# EasyEDA Pro project 2轴5.0控制板PCB源文件（LY-2X5.0-V1.1）.eprj

# Schematic 2轴南塘
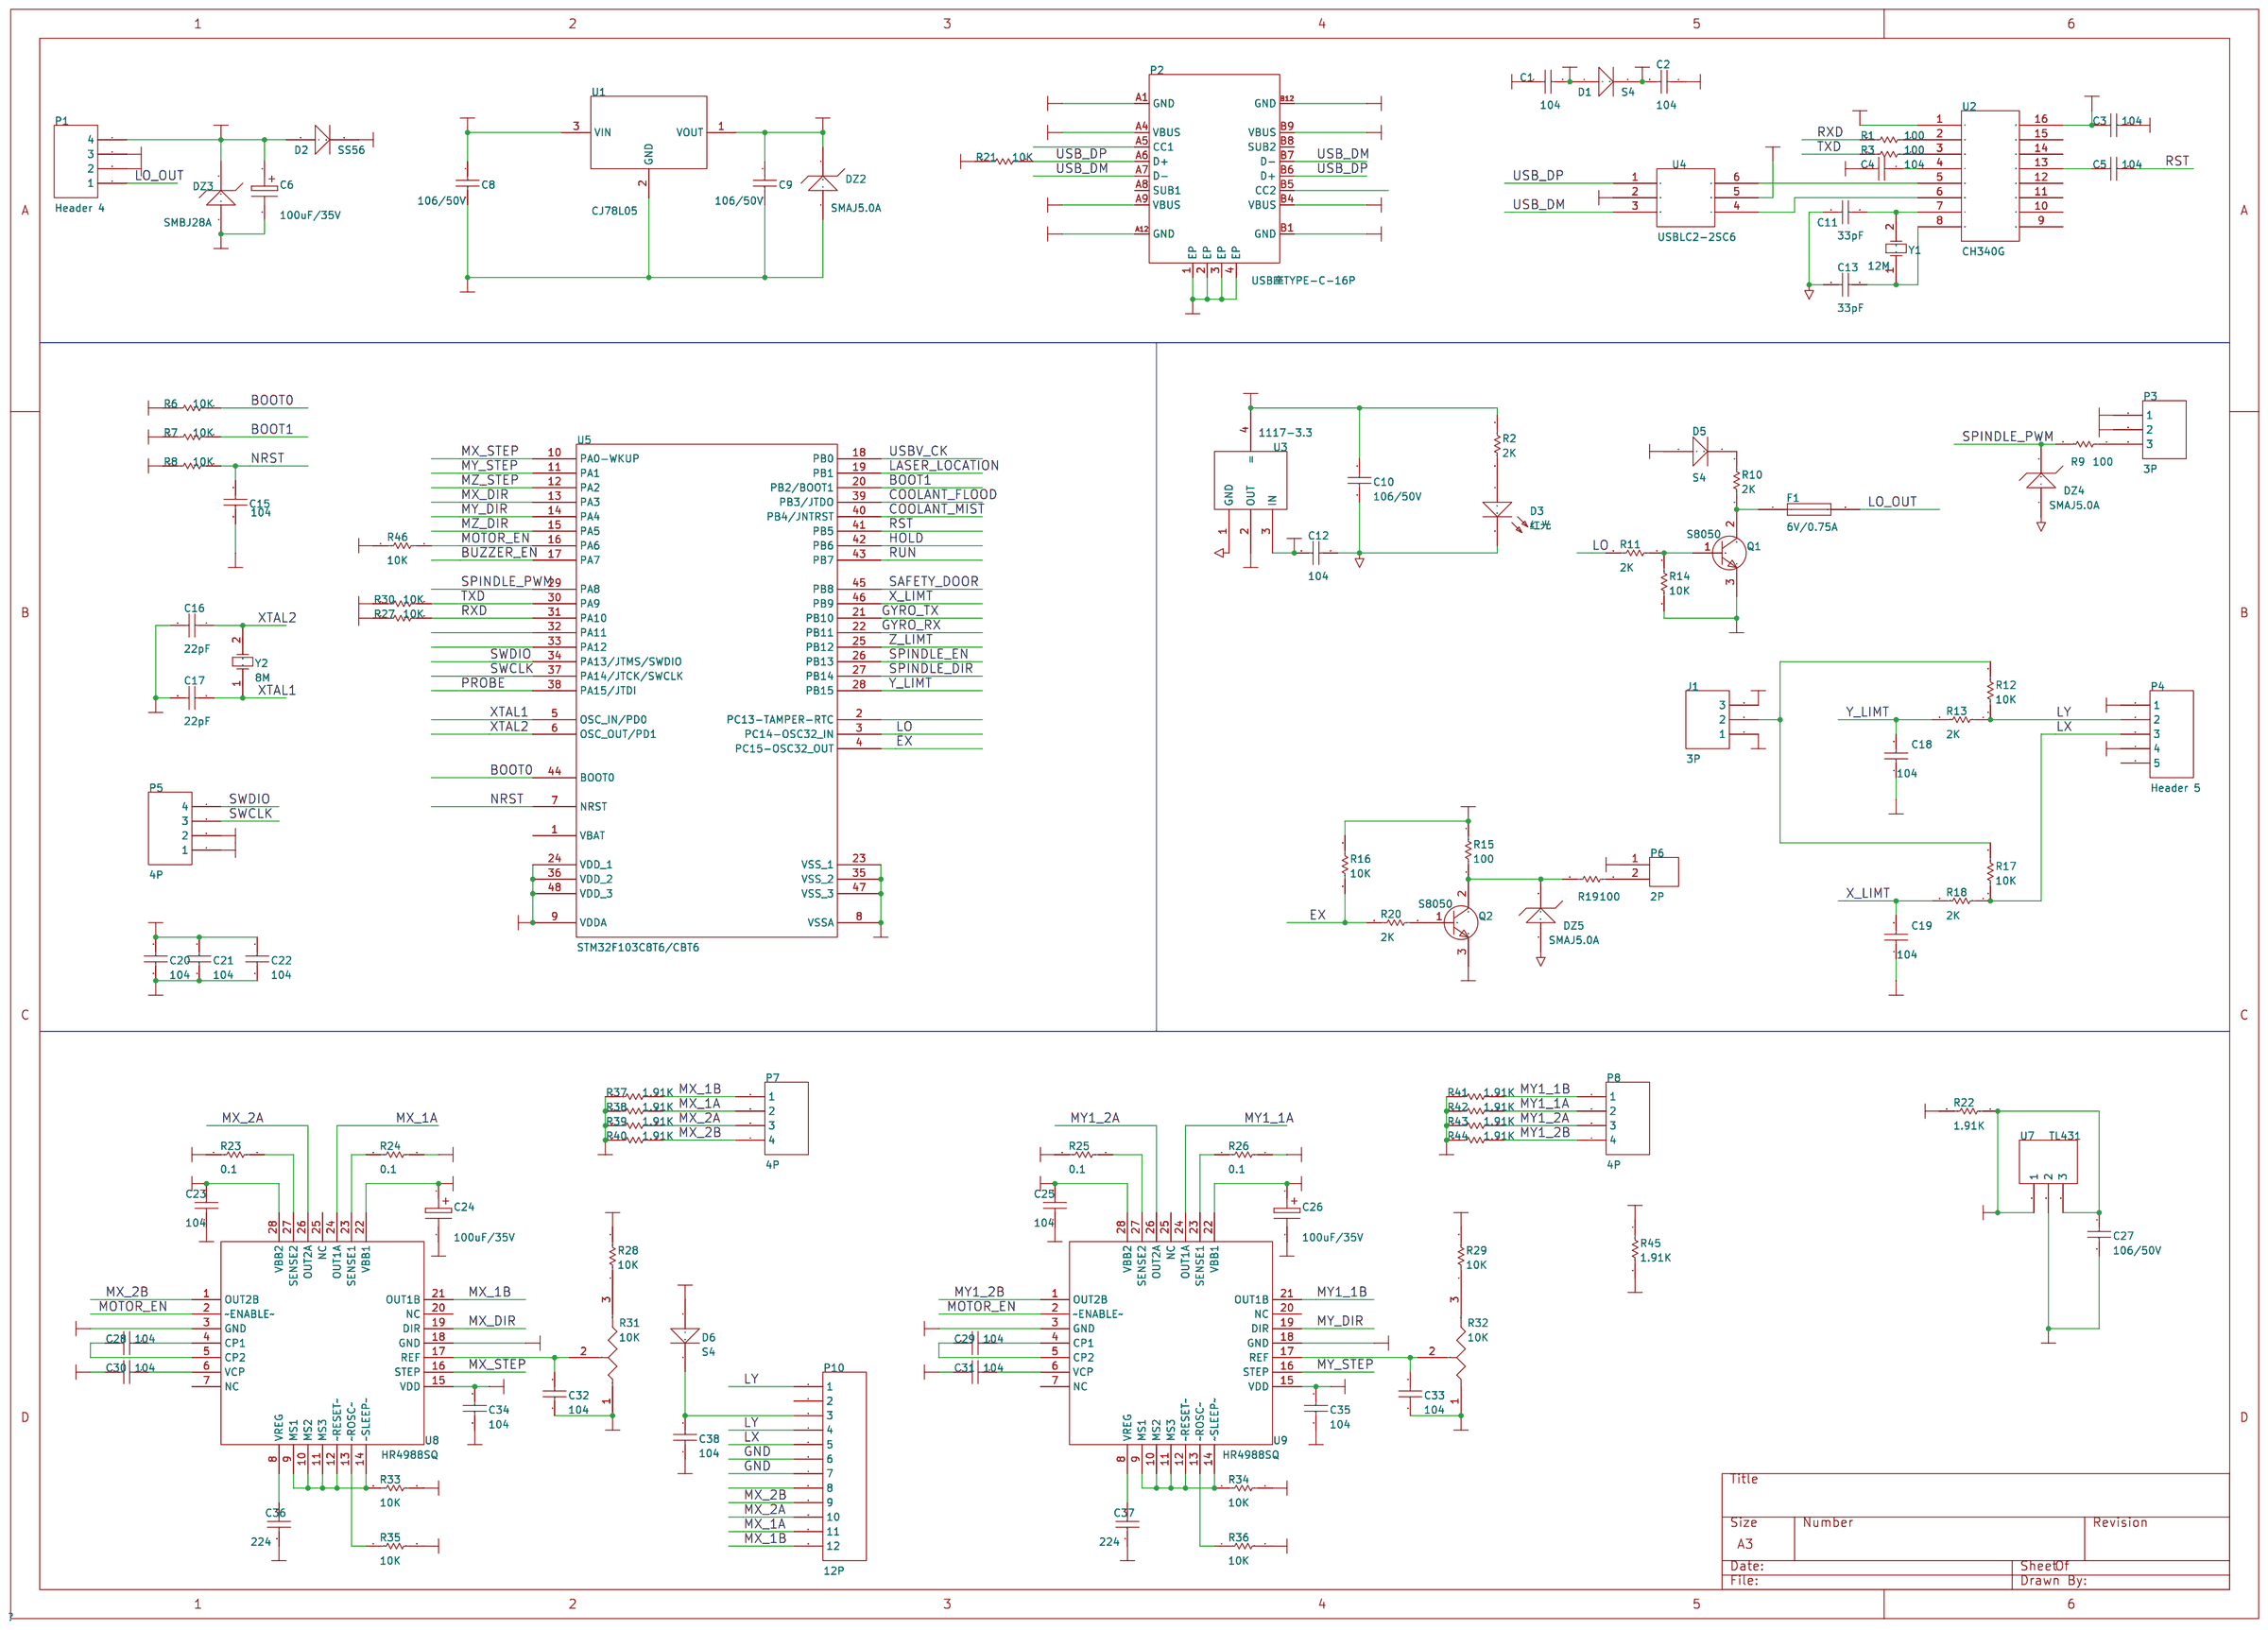
[diagram p0: schematic sheet]

## Parts
C1  104  [0603C]
C2  104  [0603C]
C3  104  [0603C]
C4  104  [0603C]
C5  104  [0603C]
C6  100uF/35V  [电容插件M6.3]
C8  106/50V  [1206C]
C9  106/50V  [电容插件M6.3]
C10  106/50V  [1206C]
C11  18pF  [0603C]
C12  104  [0603C]
C13  18pF  [0603C]
C15  104  [0603C]
C16  100pF  [0603C]
C17  100pF  [0603C]
C18  104  [0603C]
C19  104  [0603C]
C20  104  [0603C]
C21  104  [0603C]
C22  104  [0603C]
C23  104  [0603C]
C24  100uF/35V  [电容插件M6.3]
C25  104  [0603C]
C26  100uF/35V  [电容插件M6.3]
C27  106/50V  [1206C]
C28  104  [0603C]
C29  104  [0603C]
C30  104  [0603C]
C31  104  [0603C]
C32  104  [0603C]
C33  104  [0603C]
C34  104  [0603C]
C35  104  [0603C]
C36  224  [0603C]
C37  224  [0603C]
C38  104  [0603C]
D1  S4  [SOD-123]
D2  SS56  [SMA]
D3  红光  [0603LED]
D5  S4  [SOD-123]
D6  S4  [SOD-123]
DZ2  SMAJ5.0A  [SMA]
DZ3  SMBJ28A  [SMB]
DZ4  SMAJ5.0A  [SMA]
DZ5  SMAJ5.0A  [SMA]
F1  6V/0.75A  [1206R]
J1  3P  [SIP3]
P1  Header 4  [VH3.96-4P直插座]
P2  USB座TYPE-C-16P  [USB-TYPE-C-16P]
P3  3P  [HDR1X3_CON]
P4  Header 5  [HDR1X5_CON]
P5  4P  [SIP4]
P6  2P  [HDR1X2_CON]
P7  4P  [HDR1X4_CON]
P8  4P  [HDR1X4_CON]
P10  12P  [FFC/FPC直插座-1.25-12P]
Q1  S8050  [SOT-23]
Q2  S8050  [SOT-23]
R1  100  [0603R]
R2  2K  [0603R]
R3  100  [0603R]
R6  10K  [0603R]
R7  10K  [0603R]
R8  10K  [0603R]
R9  100  [0603R]
R10  2K  [0603R]
R11  2K  [0603R]
R12  10K  [0603R]
R13  2K  [0603R]
R14  10K  [0603R]
R15  100  [0603R]
R16  10K  [0603R]
R17  10K  [0603R]
R18  2K  [0603R]
R19  100  [0603R]
R20  2K  [0603R]
R21  10K  [0603R]
R22  1.91K  [1206R]
R23  0.1  [1206R]
R24  0.1  [1206R]
R25  0.1  [1206R]
R26  0.1  [1206R]
R27  10K  [0603R]
R28  10K  [0603R]
R29  10K  [0603R]
R30  10K  [0603R]
R31  10K  [松下贴片电位器3x3]
R32  10K  [松下贴片电位器3x3]
R33  10K  [0603R]
R34  10K  [0603R]
R35  10K  [0603R]
R36  10K  [0603R]
R37  1.91K  [1206R]
R38  1.91K  [1206R]
R39  1.91K  [1206R]
R40  1.91K  [1206R]
R41  1.91K  [1206R]
R42  1.91K  [1206R]
R43  1.91K  [1206R]
R44  1.91K  [1206R]
R45  1.91K  [1206R]
R46  10K  [0603R]
U1  CJ78L05  [TO-263-2]
U2  CH340G  [SOP16]
U3  1117-3.3  [SOT-223]
U4  USBLC2-2SC6  [SOT-23-6]
U5  STM32F103C8T6/CBT6  [LQFP48]
U7  TL431  [SOT-23]
U8  HR4988SQ  [QFN28]
U9  HR4988SQ  [QFN28]
Y1  12M  [晶振贴片49SSMD]
Y2  8M  [晶振贴片]

## Library data of the parts
C1-C5 C12 C15 C23 C25 C38 = 104: Capacitor (Semiconductor SIM Model); Published: 8-Jun-2000; LatestRevisionDate: 17-Jul-2002; LatestRevisionNote: Re-released for DXP Platform.; PackageReference: C1206; Publisher: Altium Limited; Origin Footprint 2: C1206; Origin Footprint 3: 0402; Origin Footprint 4: 1310[0504]; Origin Footprint 5: 1608[0603]; Origin Footprint 6: C1210; Origin Footprint 7: C0805; Origin Footprint 8: C1206; Origin Footprint 9: 0805; Origin Footprint 10: 0805L; Origin Footprint 11: 0805C; Design Item ID: Cap Semi; Library Name: Miscellaneous Devices
C6 C24 C26 = 100uF/35V: Origin Footprint 2: X47U; Design Item ID: ELECTRO1; Library Name: *
C8 C10 C27 = 106/50V: Capacitor (Semiconductor SIM Model); Published: 8-Jun-2000; LatestRevisionDate: 17-Jul-2002; LatestRevisionNote: Re-released for DXP Platform.; PackageReference: C1206; Publisher: Altium Limited; Origin Footprint 2: C1206; Origin Footprint 3: 0402; Origin Footprint 4: 1310[0504]; Origin Footprint 5: 1608[0603]; Origin Footprint 6: C1210; Origin Footprint 7: C0805; Origin Footprint 8: C1206; Origin Footprint 9: 0805; Origin Footprint 10: 0805L; Design Item ID: Cap Semi; Library Name: Miscellaneous Devices
C9 = 106/50V: Capacitor (Semiconductor SIM Model); Published: 8-Jun-2000; LatestRevisionDate: 17-Jul-2002; LatestRevisionNote: Re-released for DXP Platform.; PackageReference: C1206; Publisher: Altium Limited; Origin Footprint 2: C1206; Origin Footprint 3: 0402; Origin Footprint 4: 1310[0504]; Origin Footprint 5: 1608[0603]; Origin Footprint 6: C1210; Origin Footprint 7: C0805; Origin Footprint 8: C1206; Origin Footprint 9: 0805; Origin Footprint 10: 0805L; Origin Footprint 1: 1206C; Design Item ID: Cap Semi; Library Name: Miscellaneous Devices
C11 C13 = 33pF: Capacitor (Semiconductor SIM Model); Published: 8-Jun-2000; LatestRevisionDate: 17-Jul-2002; LatestRevisionNote: Re-released for DXP Platform.; PackageReference: C1206; Publisher: Altium Limited; Origin Footprint 2: C1206; Origin Footprint 3: 0402; Origin Footprint 4: 1310[0504]; Origin Footprint 5: 1608[0603]; Origin Footprint 6: C1210; Origin Footprint 7: C0805; Origin Footprint 8: C1206; Origin Footprint 9: 0805; Origin Footprint 10: 0805L; Design Item ID: Cap Semi; Library Name: Miscellaneous Devices
C16 C17 = 22pF: Capacitor (Semiconductor SIM Model); Published: 8-Jun-2000; LatestRevisionDate: 17-Jul-2002; LatestRevisionNote: Re-released for DXP Platform.; PackageReference: C1206; Publisher: Altium Limited; Origin Footprint 2: C1206; Origin Footprint 3: 0402; Origin Footprint 4: 1310[0504]; Origin Footprint 5: 1608[0603]; Origin Footprint 6: C1210; Origin Footprint 7: C0805; Origin Footprint 8: C1206; Origin Footprint 9: 0805; Origin Footprint 10: 0805L; Origin Footprint 11: 0805C; Design Item ID: Cap Semi; Library Name: Miscellaneous Devices
C18-C22 C28-C35 = 104: Origin Footprint 2: CAP; Origin Footprint 3: 0805C; Design Item ID: CAP; Library Name: SCH封装库
C36 C37 = 224: Design Item ID: CAP; Library Name: SCH封装库
D1 D5 D6 = S4: Design Item ID: 1N4148; Library Name: SCH封装库
D2 = SS56: Design Item ID: 1N4148; Library Name: SCH封装库
D3 = 红光: Origin Footprint 2: LED(小); Design Item ID: LED; Library Name: SCH封装库
DZ2 DZ4 DZ5 = SMAJ5.0A: Design Item ID: 稳压二极管; Library Name: SCH封装库
DZ3 = SMBJ28A: Design Item ID: 稳压二极管; Library Name: SCH封装库
F1 = 6V/0.75A: 保险丝; Design Item ID: FUSE1; Library Name: SCH封装库
J1 P3 = 3P: Library Name: SCH封装库
P1 = Header 4: Header, 4-Pin; LatestRevisionDate: 17-Jul-2002; LatestRevisionNote: Re-released for DXP Platform.; Publisher: Altium Limited; Library Name: Miscellaneous Connectors
P2 = USB座TYPE-C-16P: Supplier: LCSC; Supplier Part: C709358; Manufacturer: Shenzhen Kinghelm Elec; Manufacturer Part: KH-TYPE-C-16P-T; Library Name: SCH封装库
P4 = Header 5: Header, 5-Pin; LatestRevisionDate: 17-Jul-2002; LatestRevisionNote: Re-released for DXP Platform.; Publisher: Altium Limited; Library Name: Miscellaneous Connectors
P5 P7 P8 = 4P: Library Name: SCH封装库
P6 = 2P: Library Name: SCH封装库
P10 = 12P: Library Name: SCH封装库
Q1 Q2 = S8050: Published: 8-Jun-2000; LatestRevisionDate: 17-Jul-2002; LatestRevisionNote: Re-released for DXP Platform.; PackageReference: TO-226; Publisher: Altium Limited; Code_JEDEC: TO-226-AA; Origin Footprint 2: TO-92; Design Item ID: NPN; Library Name: SCH封装库
R1 R3 R9 R15 R19 = 100: Resistor; Published: 8-Jun-2000; LatestRevisionDate: 17-Jul-2002; LatestRevisionNote: Re-released for DXP Platform.; PackageReference: AXIAL-0.3; Publisher: Altium Limited; Origin Footprint 2: AXIAL-0.3; Origin Footprint 3: R0805; Origin Footprint 4: 0805R; Design Item ID: RES; Library Name: SCH封装库
R2 R10 R11 R13 R18 R20 = 2K: Resistor; Published: 8-Jun-2000; LatestRevisionDate: 17-Jul-2002; LatestRevisionNote: Re-released for DXP Platform.; PackageReference: AXIAL-0.3; Publisher: Altium Limited; Origin Footprint 2: AXIAL-0.3; Origin Footprint 3: R0805; Origin Footprint 4: 0805R; Design Item ID: RES; Library Name: SCH封装库
R6-R8 R27 R30 = 10k: Resistor; Published: 8-Jun-2000; LatestRevisionDate: 17-Jul-2002; LatestRevisionNote: Re-released for DXP Platform.; PackageReference: AXIAL-0.3; Publisher: Altium Limited; Origin Footprint 2: AXIAL-0.3; Origin Footprint 3: 0805R; Origin Footprint 4: 0805R; Design Item ID: RES; Library Name: SCH封装库
R12 R14 R16 R17 R28 R29 R33 R34 R46 = 10k: Resistor; Published: 8-Jun-2000; LatestRevisionDate: 17-Jul-2002; LatestRevisionNote: Re-released for DXP Platform.; PackageReference: AXIAL-0.3; Publisher: Altium Limited; Origin Footprint 2: AXIAL-0.3; Origin Footprint 3: R0805; Origin Footprint 4: 0805R; Design Item ID: RES; Library Name: SCH封装库
R21 R35 R36 = 10k: Resistor; Published: 8-Jun-2000; LatestRevisionDate: 17-Jul-2002; LatestRevisionNote: Re-released for DXP Platform.; PackageReference: AXIAL-0.3; Publisher: Altium Limited; Origin Footprint 2: AXIAL-0.3; Origin Footprint 3: R0805; Design Item ID: RES; Library Name: SCH封装库
R22 R37-R45 = 1.91K: Resistor; Published: 8-Jun-2000; LatestRevisionDate: 17-Jul-2002; LatestRevisionNote: Re-released for DXP Platform.; PackageReference: AXIAL-0.3; Publisher: Altium Limited; Origin Footprint 2: AXIAL-0.3; Origin Footprint 3: R0805; Origin Footprint 4: 0805R; Design Item ID: RES; Library Name: SCH封装库
R23-R26 = 0.1: Resistor; Published: 8-Jun-2000; LatestRevisionDate: 17-Jul-2002; LatestRevisionNote: Re-released for DXP Platform.; PackageReference: AXIAL-0.3; Publisher: Altium Limited; Origin Footprint 2: AXIAL-0.3; Origin Footprint 3: R0805; Origin Footprint 4: 0603R; Design Item ID: RES; Library Name: SCH封装库
R31 R32 = 10K: Design Item ID: 电位器; Library Name: SCH封装库
U1 = CJ78L05: Design Item ID: 78L05; Library Name: SCH封装库
U2 = CH340G: Design Item ID: DIP16; Library Name: SCH封装库
U3 = 1117-3.3: Design Item ID: LM1117; Library Name: Party600
U4 = USBLC2-2SC6: Design Item ID: DIP6; Library Name: SCH封装库
U5 = STM32F103C8T6/CBT6: STM32 ARM-based 32-bit MCU with 32 Kbytes Flash, 48-pin LQFP, Industrial Temperature; Published: *; DatasheetVersion: *; PackageVersion: *; PackageReference: *; Publisher: *; PackageDescription: *; ComponentLink1Description: *; ComponentLink1URL: *; ComponentLink2Description: *; ComponentLink2URL: *; Origin Footprint 2: LQFP48_L; Origin Footprint 3: LQFP48_M; Design Item ID: STM32F103C6T6; Library Name: ST Microcontroller 32-Bit STM32 SCH
U7 = TL431: Design Item ID: 3P; Library Name: SCH封装库
U8 U9 = HR4988SQ: Design Item ID: HR4988; Library Name: SCH封装库
Y1 = 12M: Crystal Oscillator; Published: 8-Jun-2000; LatestRevisionDate: 17-Jul-2002; LatestRevisionNote: Re-released for DXP Platform.; PackageReference: R38; Publisher: Altium Limited; Origin Footprint 2: R38; Origin Footprint 3: XTAL-49S; Design Item ID: XTAL; Library Name: Miscellaneous Devices
Y2 = 8M: Crystal Oscillator; Published: 8-Jun-2000; LatestRevisionDate: 17-Jul-2002; LatestRevisionNote: Re-released for DXP Platform.; PackageReference: R38; Publisher: Altium Limited; Origin Footprint 2: R38; Origin Footprint 3: XTAL-49S; Design Item ID: XTAL; Library Name: Miscellaneous Devices

## Nets
2.5V: C27.1 R22.1 R28.2 R29.2 U7.1 U7.3
3V3: C10.1 C20.2 C21.2 C22.2 P5.2 R2.1 R8.1 R27.1 R30.1 R46.2 U3.2(OUT) U3.4(=) U5.9(VDDA) U5.24(VDD_1) U5.36(VDD_2) U5.48(VDD_3)
5VV: D6.1 P1.2
24V: C8.1 D2.2 U1.3(VIN)
GND: C1.1 C2.1 C3.2 C4.2 C6.2 C8.2 C9.2 C10.2 C11.2 C12.1 C13.2 C15.1 C16.2 C17.2 C18.1 C19.1 C20.1 C21.1 C22.1 C23.1 C24.2 C25.1 C26.2 C27.2 C32.2 C33.2 C34.2 C35.2 C36.2 C37.2 C38.1 D3.2 DZ2.1 DZ3.1 DZ4.1 DZ5.1 J1.1 P1.3 P2.1(EP) P2.2(EP) P2.3(EP) P2.4(EP) P2.A1(GND) P2.A12(GND) P2.B1(GND) P2.B12(GND) P3.2 P4.1 P4.4 P5.1 P6.1 P10.6 P10.7 Q1.3(E) Q2.3(E) R6.1 R7.1 R14.2 R23.2 R24.1 R25.2 R26.1 R31.1(A) R32.1(A) R35.2 R36.2 R37.2 R38.2 R39.2 R40.2 R41.2 R42.2 R43.2 R44.2 R45.2 U1.2(GND) U2.1 U3.1(GND) U4.2 U5.8(VSSA) U5.23(VSS_1) U5.35(VSS_2) U5.47(VSS_3) U7.2 U8.3(GND) U8.18(GND) U9.3(GND) U9.18(GND)
VCC: C2.2 C9.1 C12.2 C34.1 C35.1 D1.2 D5.1 DZ2.2 J1.3 R15.1 R16.1 R33.1 R34.1 U1.1(VOUT) U3.3(IN) U8.15(VDD) U9.15(VDD)
BOOT0: R6.2 U5.44(BOOT0)
BOOT1: R7.2 U5.20(PB2/BOOT1)
BUZZER_EN: U5.17(PA7)
COOLANT_FLOOD: U5.39(PB3/JTDO)
COOLANT_MIST: U5.40(PB4/JNTRST)
EX: R16.2 R20.2 U5.4(PC15-OSC32_OUT)
GYRO_RX: U5.22(PB11)
GYRO_TX: U5.21(PB10)
HOLD: U5.42(PB6)
LASER_LOCATION: U5.19(PB1)
LO: R11.2 U5.3(PC14-OSC32_IN)
LO_OUT: F1.2 P1.1
LX: P4.3 P10.5 R17.2 R18.1
LY: P4.2 P10.1 P10.4 R12.1 R13.1
MOTOR_EN: R46.1 U5.16(PA6) U8.2(~ENABLE~) U9.2(~ENABLE~)
MX_1A: P7.2 P10.11 R38.1 U8.24(OUT1A)
MX_1B: P7.1 P10.12 R37.1 U8.21(OUT1B)
MX_2A: P7.3 P10.10 R39.1 U8.26(OUT2A)
MX_2B: P7.4 P10.9 R40.1 U8.1(OUT2B)
MX_DIR: U5.13(PA3) U8.19(DIR)
MX_STEP: U5.10(PA0-WKUP) U8.16(STEP)
MY1_1A: P8.2 R42.1 U9.24(OUT1A)
MY1_1B: P8.1 R41.1 U9.21(OUT1B)
MY1_2A: P8.3 R43.1 U9.26(OUT2A)
MY1_2B: P8.4 R44.1 U9.1(OUT2B)
MY_DIR: U5.14(PA4) U9.19(DIR)
MY_STEP: U5.11(PA1) U9.16(STEP)
MZ_DIR: U5.15(PA5)
MZ_STEP: U5.12(PA2)
NRST: C15.2 R8.2 U5.7(NRST)
PROBE: U5.38(PA15/JTDI)
RST: C5.2 U5.41(PB5)
RUN: U5.43(PB7)
RXD: R1.2 R27.2 U5.31(PA10)
SAFETY_DOOR: U5.45(PB8)
SPINDLE_DIR: U5.27(PB14)
SPINDLE_EN: U5.26(PB13)
SPINDLE_PWM: DZ4.2 R9.2 U5.29(PA8)
SWCLK: P5.3 U5.37(PA14/JTCK/SWCLK)
SWDIO: P5.4 U5.34(PA13/JTMS/SWDIO)
TXD: R3.2 R30.2 U5.30(PA9)
USB_DM: P2.A7(D-) P2.B7(D-) U4.3
USB_DP: P2.A6(D+) P2.B6(D+) R21.2 U4.1
USBV_CK: U5.18(PB0)
VM: C6.1 C23.2 C24.1 C25.2 C26.1 C30.2 C31.2 D2.1 DZ3.2 P1.4 P3.1 R22.2 R45.1 U8.22(VBB1) U8.28(VBB2) U9.22(VBB1) U9.28(VBB2)
VUSB: C1.2 C3.1 D1.1 P2.A4(VBUS) P2.A9(VBUS) P2.B4(VBUS) P2.B9(VBUS) R21.1 U2.16 U4.5
X_LIMT: C19.2 R18.2 U5.46(PB9)
XTAL1: C17.1 U5.5(OSC_IN/PD0) Y2.1(OSC1)
XTAL2: C16.1 U5.6(OSC_OUT/PD1) Y2.2(OSC2)
Y_LIMT: C18.2 R13.2 U5.28(PB15)
Z_LIMT: U5.25(PB12)
NETC4_1: C4.1 U2.4
NETC5_1: C5.1 U2.13
NETC11_1: C11.1 U2.7 Y1.2(OSC2)
NETC13_1: C13.1 U2.8 Y1.1(OSC1)
NETC28_1: C28.1 U8.4(CP1)
NETC28_2: C28.2 U8.5(CP2)
NETC29_1: C29.1 U9.4(CP1)
NETC29_2: C29.2 U9.5(CP2)
NETC30_1: C30.1 U8.6(VCP)
NETC31_1: C31.1 U9.6(VCP)
NETC32_1: C32.1 R31.2(TAP) U8.17(REF)
NETC33_1: C33.1 R32.2(TAP) U9.17(REF)
NETC36_1: C36.1 U8.8(VREG)
NETC37_1: C37.1 U9.8(VREG)
NETC38_2: C38.2 D6.2 P10.3
NETD3_1: D3.1 R2.2
NETD5_2: D5.2 R10.1
NETDZ5_2: DZ5.2 Q2.2(C) R15.2 R19.2
NETF1_1: F1.1 Q1.2(C) R10.2
NETJ1_2: J1.2 R12.2 R17.1
NETP3_3: P3.3 R9.1
NETP6_2: P6.2 R19.1
NETQ1_1: Q1.1(B) R11.1 R14.1
NETQ2_1: Q2.1(B) R20.1
NETR1_1: R1.1 U2.2
NETR3_1: R3.1 U2.3
NETR23_1: R23.1 U8.27(SENSE2)
NETR24_2: R24.2 U8.23(SENSE1)
NETR25_1: R25.1 U9.27(SENSE2)
NETR26_2: R26.2 U9.23(SENSE1)
NETR28_1: R28.1 R31.3(B)
NETR29_1: R29.1 R32.3(B)
NETR33_2: R33.2 U8.9(MS1) U8.10(MS2) U8.11(MS3) U8.12(~RESET~) U8.14(~SLEEP~)
NETR34_2: R34.2 U9.9(MS1) U9.10(MS2) U9.11(MS3) U9.12(~RESET~) U9.14(~SLEEP~)
NETR35_1: R35.1 U8.13(~ROSC~)
NETR36_1: R36.1 U9.13(~ROSC~)
NETU2_5: U2.5 U4.6
NETU2_6: U2.6 U4.4

Not connected (* = marked no-connect by the designer): P2 A5(CC1) A8(SUB1) B5(CC2) B8(SUB2); P4 5; P10 2 8; U2 9 10 11 12 14 15; U5 1(VBAT) 2(PC13-TAMPER-RTC) 32(PA11) 33(PA12); U8 7(NC) 20(NC) 25(NC); U9 7(NC) 20(NC) 25(NC)

# Board 2轴南塘
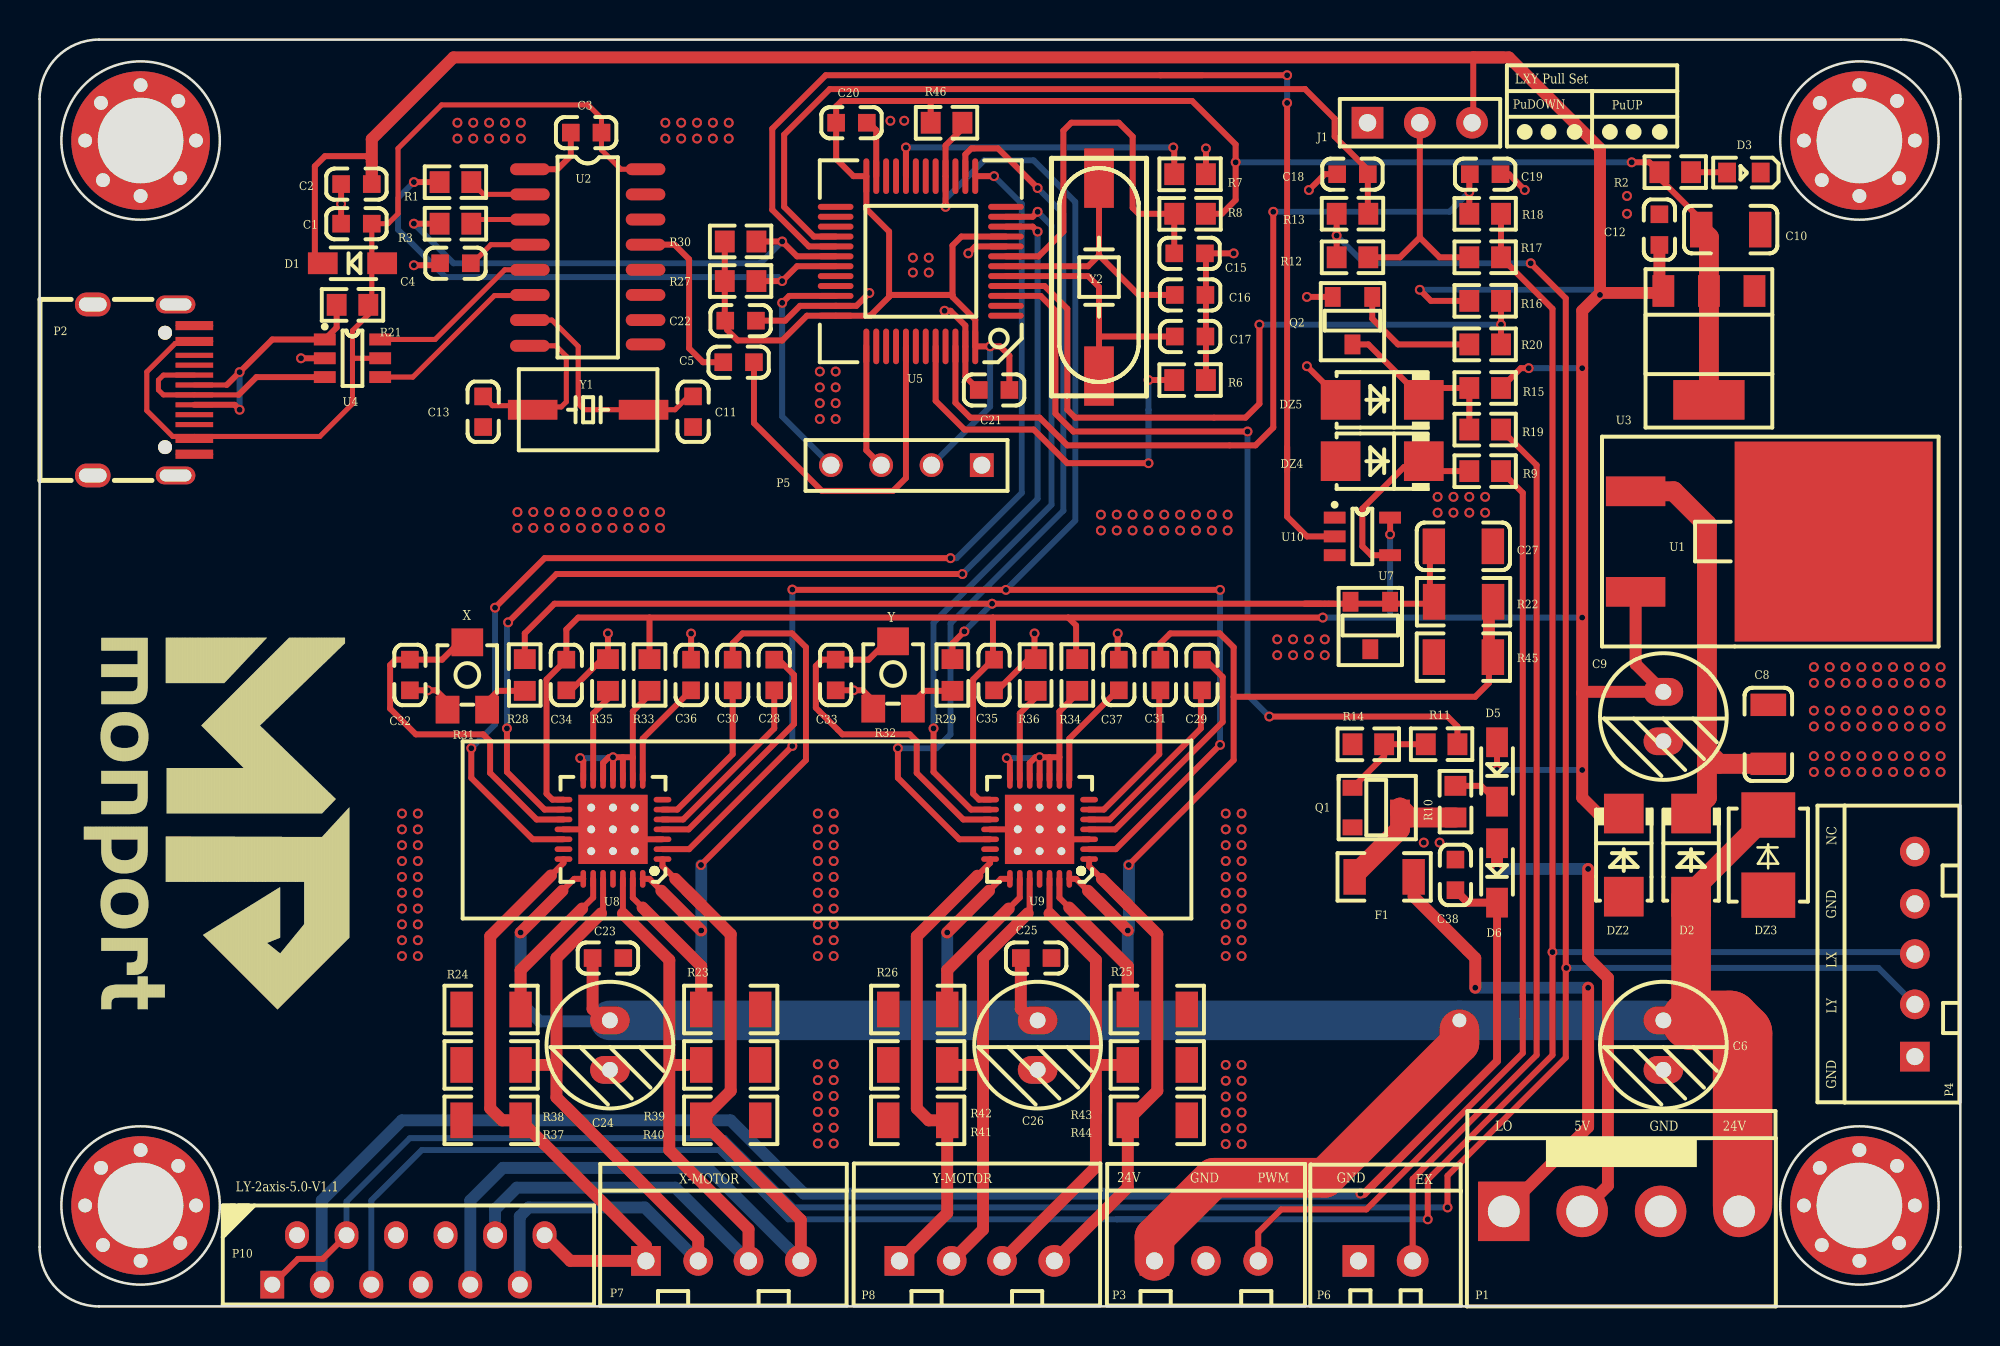
[diagram p1: board, top side]
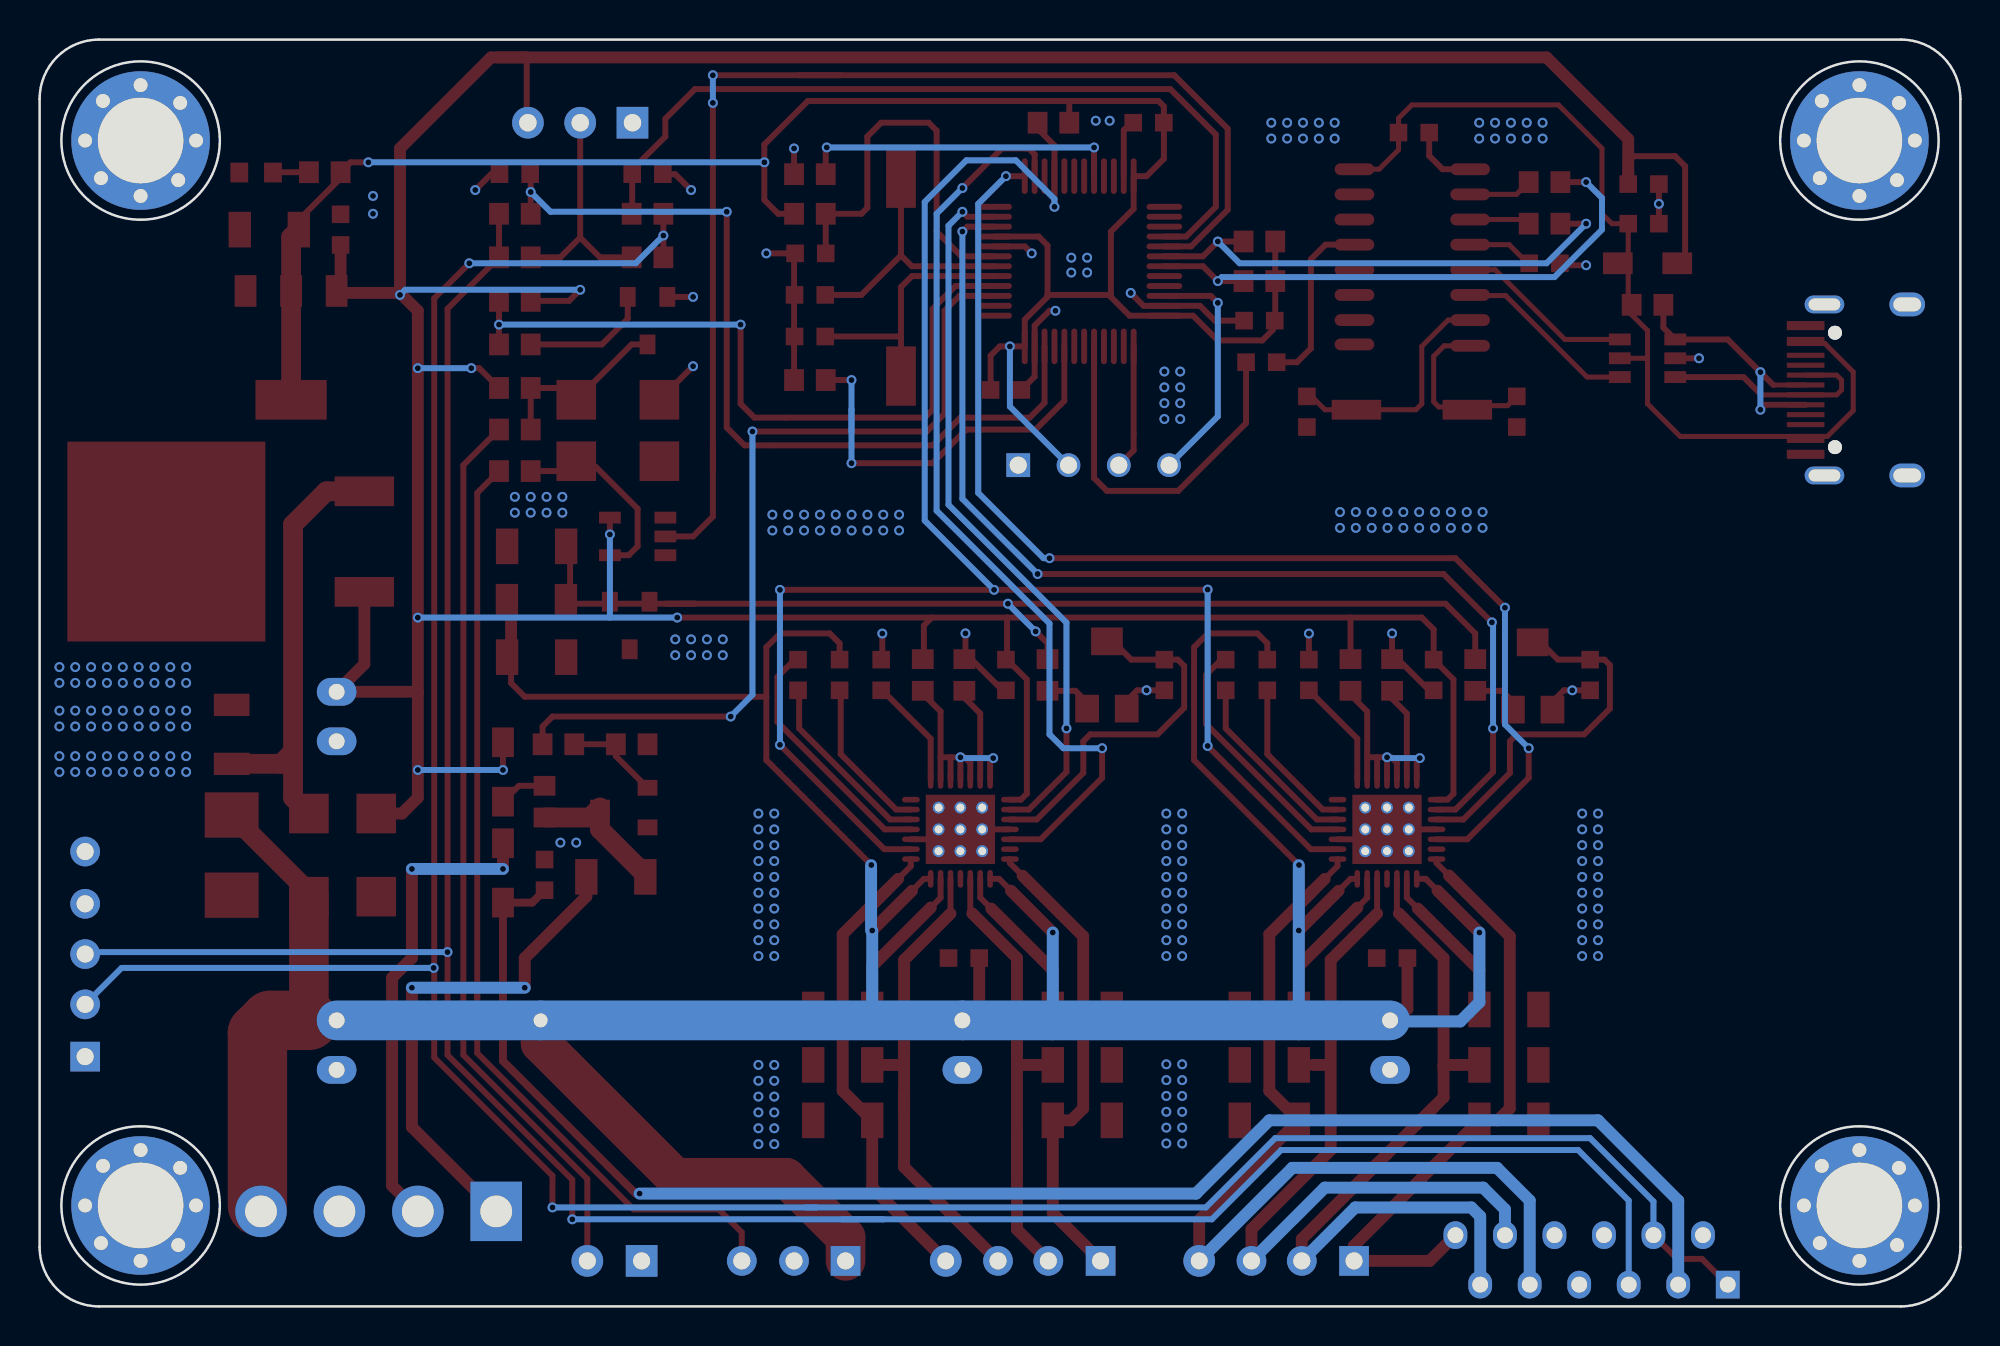
[diagram p2: board, bottom side, seen from below]

Outline 97 x 64 mm; copper layers: Top Layer, Bottom Layer. Coordinates in mm from the lower left corner of the outline.
Outline path: circle c5.1,58.9 r4 ; circle c5.1,5.1 r4 ; circle c91.9,58.9 r4 ; circle c91.9,5.1 r4 ; 0,61 0,3 arc(0.88,0.88) 3,0 94,0 arc(96.12,0.88) 97,3 97,61 arc(96.12,63.12) 94,64 3,64 arc(0.88,63.12) 0,61

## Placement (name value [footprint] x y rotation side)
C1  104  [0603C]  16 54.7 0 top
C2  104  [0603C]  16 56.7 0 top
C3  104  [0603C]  27.6 59.3 180 top
C4  104  [0603C]  21 52.7 180 top
C5  104  [0603C]  35.3 47.7 0 top
C6  100uF/35V  [电容插件M6.3]  82 13.2 270 top
C8  106/50V  [1206C]  87.3 28.9 90 top
C9  106/50V  [电容插件M6.3]  82 29.8 270 top
C10  106/50V  [1206C]  85.4 54.4 0 top
C11  18pF  [0603C]  33 45.2 270 top
C12  104  [0603C]  81.8 54.4 270 top
C13  18pF  [0603C]  22.4 45.2 270 top
C15  104  [0603C]  58.07 53.2 180 top
C16  100pF  [0603C]  58.1 51.1 0 top
C17  100pF  [0603C]  58.1 49 0 top
C18  104  [0603C]  66.3 57.2 0 top
C19  104  [0603C]  73 57.2 180 top
C20  104  [0603C]  41 59.8 180 top
C21  104  [0603C]  48.2 46.3 0 top
C22  104  [0603C]  35.4 49.8 180 top
C23  104  [0603C]  28.7 17.6 180 top
C24  100uF/35V  [电容插件M6.3]  28.8 13.2 270 top
C25  104  [0603C]  50.33 17.6 180 top
C26  100uF/35V  [电容插件M6.3]  50.4 13.2 270 top
C27  106/50V  [1206C]  71.9 38.4 0 top
C28  104  [0603C]  37.1 31.9 270 top
C29  104  [0603C]  58.7 31.9 270 top
C30  104  [0603C]  35 31.9 90 top
C31  104  [0603C]  56.6 31.9 90 top
C32  104  [0603C]  18.7 31.9 270 top
C33  104  [0603C]  40.2 31.9 270 top
C34  104  [0603C]  26.6 31.9 270 top
C35  104  [0603C]  48.2 31.9 270 top
C36  224  [0603C]  32.9 31.9 90 top
C37  224  [0603C]  54.5 31.9 90 top
C38  104  [0603C]  71.5 21.8 270 top
D1  S4  [SOD-123]  15.8 52.7 180 top
D2  SS56  [SMA]  83.4 22.8 270 top
D3  红光  [0603LED]  86.1 57.3 0 top
D5  S4  [SOD-123]  73.6 27 270 top
D6  S4  [SOD-123]  73.6 21.9 270 top
DZ2  SMAJ5.0A  [SMA]  80 22.8 270 top
DZ3  SMBJ28A  [SMB]  87.3 22.8 270 top
DZ4  SMAJ5.0A  [SMA]  67.8 42.7 180 top
DZ5  SMAJ5.0A  [SMA]  67.8 45.8 180 top
F1  6V/0.75A  [1206R]  67.9 21.7 0 top
J1  3P  [SIP3]  67.16 59.8 0 top
NOREF  -  [Pad_ie93]  89.9 60.8 180 top
NOREF#2  -  [Pad_ie92]  90 56.9 270 top
NOREF#3  -  [Pad_ie72]  5.1 5.1 90 top
NOREF#4  -  [Pad_ie62]  30.06 25.2 0 top
NOREF#5  -  [Pad_ie83]  7.9 58.9 0 top
NOREF#6  -  [Pad_ie65]  7.1 3.2 0 top
NOREF#7  -  [Pad_ie55]  27.86 23 180 top
NOREF#8  -  [Pad_ie48]  50.5 23 270 top
NOREF#9  -  [Pad_ie60]  28.96 24.1 270 top
NOREF#10  -  [Pad_ie61]  27.86 25.2 180 top
NOREF#11  -  [Pad_ie66]  3.2 3.1 270 top
NOREF#12  -  [Pad_ie68]  7.9 5.1 0 top
NOREF#13  -  [Pad_ie49]  49.4 24.1 180 top
NOREF#14  -  [Pad_ie54]  50.5 25.2 0 top
NOREF#15  -  [Pad_ie95]  93.9 57 0 top
NOREF#16  -  [Pad_ie50]  51.6 24.1 0 top
NOREF#17  -  [仑业LOGO-MONPORT]  9.06 24.4 270 top
NOREF#18  -  [Pad_ie87]  7 60.9 90 top
NOREF#19  -  [Pad_ie74]  89.1 5.1 180 top
NOREF#20  -  [Pad_ie51]  50.5 24.1 270 top
NOREF#21  -  [Pad_ie81]  89.9 7 180 top
NOREF#22  -  [Pad_ie98]  94.7 58.9 0 top
NOREF#23  -  [Pad_ie71]  5.1 7.9 90 top
NOREF#24  -  [Pad_ie53]  51.6 25.2 0 top
NOREF#25  -  [Pad_ie56]  30.06 23 0 top
NOREF#26  -  [Pad_ie59]  30.06 24.1 0 top
NOREF#27  -  [Pad_ie73]  91.9 5.1 180 top
NOREF#28  -  [Pad_ie67]  3.1 7 180 top
NOREF#29  -  [Pad_ie89]  3.2 56.9 270 top
NOREF#30  -  [Pad_ie46]  49.4 23 180 top
NOREF#31  -  [Pad_ie70]  2.3 5.1 180 top
NOREF#32  -  [Pad_ie80]  93.8 7.1 90 top
NOREF#33  -  [Pad_ie64]  7 7.1 90 top
NOREF#34  -  [Pad_ie96]  89.1 58.9 180 top
NOREF#35  -  [Pad_ie69]  5.1 2.3 270 top
NOREF#36  -  [Pad_ie47]  51.6 23 0 top
NOREF#37  -  [Pad_ie63]  28.96 25.2 0 top
NOREF#38  -  [Pad_ie78]  90 3.1 270 top
NOREF#39  -  [Pad_ie97]  91.9 61.7 90 top
NOREF#40  -  [Pad_ie99]  91.9 56.1 270 top
NOREF#41  -  [Pad_ie100]  91.9 58.9 270 top
NOREF#42  -  [Pad_ie77]  91.9 7.9 90 top
NOREF#43  -  [Pad_ie94]  93.8 60.9 90 top
NOREF#44  -  [Pad_ie88]  3.1 60.8 180 top
NOREF#45  -  [Pad_ie86]  5.1 56.1 270 top
NOREF#46  -  [Pad_ie85]  2.3 58.9 180 top
NOREF#47  -  [Pad_ie58]  27.86 24.1 180 top
NOREF#48  -  [Pad_ie76]  94.7 5.1 0 top
NOREF#49  -  [Pad_ie57]  28.96 23 270 top
NOREF#50  -  [Pad_ie84]  5.1 61.7 90 top
NOREF#51  -  [Pad_ie79]  93.9 3.2 0 top
NOREF#52  -  [Pad_ie52]  49.4 25.2 180 top
NOREF#53  -  [Pad_ie90]  7.1 57 0 top
NOREF#54  -  [Pad_ie82]  5.1 58.9 0 top
NOREF#55  -  [Pad_ie91]  71.7 14.45 90 top
NOREF#56  -  [Pad_ie75]  91.9 2.3 270 top
P1  Header 4  [VH3.96-4P直插座]  79.88 4.5 180 top
P2  USB座TYPE-C-16P  [USB-TYPE-C-16P]  5.1 46.3 270 top
P3  3P  [HDR1X3_CON]  58.9 2.3 0 top
P4  Header 5  [HDR1X5_CON]  94.7 17.8 90 top
P5  4P  [SIP4]  47.58 42.5 180 top
P6  2P  [HDR1X2_CON]  67.97 2.3 0 top
P7  4P  [HDR1X4_CON]  30.72 2.3 0 top
P8  4P  [HDR1X4_CON]  43.52 2.3 0 top
P10  12P  [FFC/FPC直插座-1.25-12P]  11.75 1.1 0 top
Q1  S8050  [SOT-23]  67.5 25.2 270 top
Q2  S8050  [SOT-23]  66.3 49.8 180 top
R1  100  [0603R]  21 56.8 180 top
R2  2K  [0603R]  82.6 57.3 0 top
R3  100  [0603R]  21 54.7 180 top
R6  10K  [0603R]  58.1 46.8 180 top
R7  10K  [0603R]  58.1 57.2 180 top
R8  10K  [0603R]  58.1 55.2 180 top
R9  100  [0603R]  73 42.2 180 top
R10  2K  [0603R]  71.5 25.5 270 top
R11  2K  [0603R]  70.8 28.4 0 top
R12  10K  [0603R]  66.3 53 0 top
R13  2K  [0603R]  66.3 55.2 0 top
R14  10K  [0603R]  67.1 28.4 180 top
R15  100  [0603R]  73 46.4 180 top
R16  10K  [0603R]  73 50.8 0 top
R17  10K  [0603R]  73 53 0 top
R18  2K  [0603R]  73 55.2 180 top
R19  100  [0603R]  73 44.3 180 top
R20  2K  [0603R]  73 48.6 0 top
R21  10K  [0603R]  15.8 50.6 180 top
R22  1.91K  [1206R]  71.91 35.6 0 top
R23  0.1  [1206R]  34.9 15 0 top
R24  0.1  [1206R]  22.8 15 0 top
R25  0.1  [1206R]  56.44 15 0 top
R26  0.1  [1206R]  44.34 15 0 top
R27  10K  [0603R]  35.4 51.8 0 top
R28  10K  [0603R]  24.5 31.9 90 top
R29  10K  [0603R]  46.1 31.9 90 top
R30  10K  [0603R]  35.4 53.8 0 top
R31  10K  [松下贴片电位器3x3]  21.6 31.9 0 top
R32  10K  [松下贴片电位器3x3]  43.1 31.95 0 top
R33  10K  [0603R]  30.8 31.9 270 top
R34  10K  [0603R]  52.4 31.9 270 top
R35  10K  [0603R]  28.7 31.9 90 top
R36  10K  [0603R]  50.3 31.9 90 top
R37  1.91K  [1206R]  22.8 9.4 180 top
R38  1.91K  [1206R]  22.8 12.2 180 top
R39  1.91K  [1206R]  34.9 12.2 0 top
R40  1.91K  [1206R]  34.9 9.4 0 top
R41  1.91K  [1206R]  44.34 9.4 180 top
R42  1.91K  [1206R]  44.34 12.2 180 top
R43  1.91K  [1206R]  56.44 12.2 0 top
R44  1.91K  [1206R]  56.44 9.4 0 top
R45  1.91K  [1206R]  71.9 32.8 180 top
R46  10K  [0603R]  45.8 59.8 180 top
U1  CJ78L05  [TO-263-2]  80.6 38.64 180 top
U2  CH340G  [SOP16]  27.68 53.64 0 top
U3  1117-3.3  [SOT-223]  84.3 48.6 180 top
U4  USBLC2-2SC6  [SOT-23-6]  15.8 47.9 0 top
U5  STM32F103C8T6/CBT6  [LQFP48]  44.5 52.8 180 top
U7  TL431  [SOT-23]  67.2 34.4 180 top
U8  HR4988SQ  [QFN28]  28.7 24.2 90 top
U9  HR4988SQ  [QFN28]  50.24 24.2 90 top
U10  74LVC1G17  [SOT-23-5]  66.8 38.9 0 top
Y1  12M  [晶振贴片49SSMD]  27.7 45.3 0 top
Y2  8M  [晶振贴片]  53.5 52 90 top

## Footprints (pads in the part's own frame, mm; a bottom-side part is the same pattern mirrored in y, then rotated)
0603C
  rect 0.889x0.889 smd: 1(-0.774,0) 2(0.774,0)
0603LED
  rect 0.9x1 smd: 1(-0.884,-0.017) 2(0.816,-0.017)
0603R
  rect 1x1.1 smd: 1(-0.8,0) 2(0.8,0)
1206C
  rect 1.13x1.8 smd: 1(-1.49,0) 2(1.49,0)
1206R
  rect 1.13x1.8 smd: 1(-1.49,0) 2(1.49,0)
FFC/FPC直插座-1.25-12P
  rect 1.2x1.4 hole 0.8: 1(0,0)
  oval 1.2x1.4 hole 0.8: 2(1.25,2.5) 3(2.5,0) 4(3.75,2.5) 5(5,0) 6(6.25,2.5) 7(7.5,0) 8(8.75,2.5) 9(10,0) 10(11.25,2.5) 11(12.5,0) 12(13.75,2.5)
HDR1X2_CON
  rect 1.6x1.6 hole 0.86: 1(-1.37,0)
  round 1.6 hole 0.86: 2(1.37,0)
HDR1X3_CON
  rect 1.5x1.5 hole 0.86: 1(-2.6,0)
  round 1.5 hole 0.86: 2(0,0) 3(2.64,0)
HDR1X4_CON
  rect 1.5x1.5 hole 0.86: 1(-0.1,0)
  round 1.5 hole 0.86: 2(2.54,0) 3(5.08,0)
  round 1.6 hole 0.85: 4(7.72,0)
HDR1X5_CON
  rect 1.5x1.5 hole 0.86: 1(-5.18,0)
  round 1.5 hole 0.86: 2(-2.54,0) 3(0,0) 4(2.54,0) 5(5.18,0)
LQFP48
  oval 1.8x0.3 smd: 1(-4.3,2.75) 2(-4.3,2.25) 3(-4.3,1.75) 4(-4.3,1.25) 5(-4.3,0.75) 6(-4.3,0.25) 7(-4.3,-0.25) 8(-4.3,-0.75) 9(-4.3,-1.25) 10(-4.3,-1.75) 11(-4.3,-2.25) 12(-4.3,-2.75) 25(4.3,-2.75) 26(4.3,-2.25) 27(4.3,-1.75) 28(4.3,-1.25) 29(4.3,-0.75) 30(4.3,-0.25) 31(4.3,0.25) 32(4.3,0.75) 33(4.3,1.25) 34(4.3,1.75) 35(4.3,2.25) 36(4.3,2.75)
  oval 0.3x1.8 smd: 13(-2.75,-4.3) 14(-2.25,-4.3) 15(-1.75,-4.3) 16(-1.25,-4.3) 17(-0.75,-4.3) 18(-0.25,-4.3) 19(0.25,-4.3) 20(0.75,-4.3) 21(1.25,-4.3) 22(1.75,-4.3) 23(2.25,-4.3) 24(2.75,-4.3) 37(2.75,4.3) 38(2.25,4.3) 39(1.75,4.3) 40(1.25,4.3) 41(0.75,4.3) 42(0.25,4.3) 43(-0.25,4.3) 44(-0.75,4.3) 45(-1.25,4.3) 46(-1.75,4.3) 47(-2.25,4.3) 48(-2.75,4.3)
Pad_ie46
  round 0.6 hole 0.4: 5(0,0)
Pad_ie47
  round 0.6 hole 0.4: 5(0,0)
Pad_ie48
  round 0.6 hole 0.4: 5(0,0)
Pad_ie49
  round 0.6 hole 0.4: 5(0,0)
Pad_ie50
  round 0.6 hole 0.4: 5(0,0)
Pad_ie51
  round 0.6 hole 0.4: 5(0,0)
Pad_ie52
  round 0.6 hole 0.4: 5(0,0)
Pad_ie53
  round 0.6 hole 0.4: 5(0,0)
Pad_ie54
  round 0.6 hole 0.4: 4(0,0)
Pad_ie55
  round 0.6 hole 0.4: 5(0,0)
Pad_ie56
  round 0.6 hole 0.4: 5(0,0)
Pad_ie57
  round 0.6 hole 0.4: 5(0,0)
Pad_ie58
  round 0.6 hole 0.4: 5(0,0)
Pad_ie59
  round 0.6 hole 0.4: 5(0,0)
Pad_ie60
  round 0.6 hole 0.4: 5(0,0)
Pad_ie61
  round 0.6 hole 0.4: 5(0,0)
Pad_ie62
  round 0.6 hole 0.4: 5(0,0)
Pad_ie63
  round 0.6 hole 0.4: 4(0,0)
Pad_ie64
  round 1 hole 0.7: 1(0,0)
Pad_ie65
  round 1 hole 0.7: 1(0,0)
Pad_ie66
  round 1 hole 0.7: 1(0,0)
Pad_ie67
  round 1 hole 0.7: 1(0,0)
Pad_ie68
  round 1 hole 0.7: 1(0,0)
Pad_ie69
  round 1 hole 0.7: 1(0,0)
Pad_ie70
  round 1 hole 0.7: 1(0,0)
Pad_ie71
  round 1 hole 0.7: 1(0,0)
Pad_ie72
  round 7 hole 4.32: 0(0,0)
Pad_ie73
  round 7 hole 4.32: 0(0,0)
Pad_ie74
  round 1 hole 0.7: 1(0,0)
Pad_ie75
  round 1 hole 0.7: 1(0,0)
Pad_ie76
  round 1 hole 0.7: 1(0,0)
Pad_ie77
  round 1 hole 0.7: 1(0,0)
Pad_ie78
  round 1 hole 0.7: 1(0,0)
Pad_ie79
  round 1 hole 0.7: 1(0,0)
Pad_ie80
  round 1 hole 0.7: 1(0,0)
Pad_ie81
  round 1 hole 0.7: 1(0,0)
Pad_ie82
  round 7 hole 4.32: 0(0,0)
Pad_ie83
  round 1 hole 0.7: 1(0,0)
Pad_ie84
  round 1 hole 0.7: 1(0,0)
Pad_ie85
  round 1 hole 0.7: 1(0,0)
Pad_ie86
  round 1 hole 0.7: 1(0,0)
Pad_ie87
  round 1 hole 0.7: 1(0,0)
Pad_ie88
  round 1 hole 0.7: 1(0,0)
Pad_ie89
  round 1 hole 0.7: 1(0,0)
Pad_ie90
  round 1 hole 0.7: 1(0,0)
Pad_ie91
  round 1 hole 0.7: 2(0,0)
Pad_ie92
  round 1 hole 0.7: 1(0,0)
Pad_ie93
  round 1 hole 0.7: 1(0,0)
Pad_ie94
  round 1 hole 0.7: 1(0,0)
Pad_ie95
  round 1 hole 0.7: 1(0,0)
Pad_ie96
  round 1 hole 0.7: 1(0,0)
Pad_ie97
  round 1 hole 0.7: 1(0,0)
Pad_ie98
  round 1 hole 0.7: 1(0,0)
Pad_ie99
  round 1 hole 0.7: 1(0,0)
Pad_ie100
  round 7 hole 4.32: 0(0,0)
QFN28
  oval 0.28x0.895 smd: 1(-1.601,-2.756) 2(-1.101,-2.756) 3(-0.601,-2.756) 4(-0.1,-2.756) 5(0.401,-2.756) 6(0.9,-2.756) 7(1.401,-2.756) 15(1.401,2.244) 16(0.9,2.244) 17(0.401,2.244) 18(-0.1,2.244) 19(-0.601,2.244) 20(-1.101,2.244) 21(-1.601,2.244)
  oval 0.895x0.28 smd: 8(2.4,-1.758) 9(2.4,-1.257) 10(2.4,-0.756) 11(2.4,-0.256) 12(2.4,0.244) 13(2.4,0.745) 14(2.4,1.245) 22(-2.6,1.245) 23(-2.6,0.745) 24(-2.6,0.244) 25(-2.6,-0.256) 26(-2.6,-0.756) 27(-2.6,-1.257) 28(-2.6,-1.758)
  rect 3.5x3.5 smd: 29(-0.1,-0.256)
SIP3
  rect 1.6x1.6 hole 0.88: 1(-0.1,0)
  round 1.6 hole 0.88: 2(2.54,0) 3(5.18,0)
SIP4
  rect 1.2x1.2 hole 0.86: 1(0,0)
  round 1.2 hole 0.86: 2(2.54,0) 3(5.08,0) 4(7.62,0)
SMA
  rect 2x2 smd: 1(2.1,0) 2(-2.1,0)
SMB
  rect 2.29x2.72 smd: 1(2.025,0) 2(-2.025,0)
SOD-123
  rect 1.5x1.1 smd: 1(-1.5,0) 2(1.5,0)
SOP16
  oval 2x0.6 smd: 1(-2.921,3.81) 2(-2.921,2.54) 3(-2.921,1.27) 4(-2.921,0) 5(-2.921,-1.27) 6(-2.921,-2.54) 7(-2.921,-3.81) 8(-2.921,-5.11) 9(2.921,-5.04) 10(2.921,-3.81) 11(2.921,-2.54) 12(2.921,-1.27) 13(2.921,0) 14(2.921,1.27) 15(2.921,2.54) 16(2.921,3.81)
SOT-23
  rect 0.8x1 smd: 1(-1,-1.2) 2(0,1.2) 3(1,-1.2)
SOT-23-5
  rect 1.1x0.6 smd: 1(-1.4,0.95) 2(-1.4,0) 3(-1.4,-0.95) 4(1.4,-0.95) 5(1.4,0.95)
SOT-23-6
  rect 1.1x0.6 smd: 1(-1.4,0.95) 2(-1.4,0) 3(-1.4,-0.95) 4(1.4,-0.95) 5(1.4,0) 6(1.4,0.95)
SOT-223
  rect 1.1x1.6 smd: 1(-2.3,-2.7) 2(0,-2.7) 3(2.3,-2.7)
  rect 3.6x2 smd: 4(0,2.8)
TO-263-2
  rect 3x1.5 smd: 1(0,-2.54) 3(0,2.54)
  rect 10x10.1 smd: 2(-10,0)
USB-TYPE-C-16P
  round 0.7 hole 0.7: (-2.89,1.235) (2.89,1.235)
  oval 0.9x2 hole 0.6x1.6: 1(-4.32,1.765) 2(4.32,1.765)
  oval 1.2x1.8 hole 0.7x1.4: 3(-4.32,-2.415) 4(4.32,-2.415)
  rect 0.26x1.9 smd: A1(-3.35,2.715) A4(-2.55,2.715) A5(-1.25,2.715) A6(-0.25,2.715) A7(0.25,2.715) A8(1.25,2.715) A9(2.55,2.715) A12(3.35,2.715) B1(3.15,2.715) B4(2.35,2.715) B5(1.75,2.715) B6(0.75,2.715) B7(-0.75,2.715) B8(-1.75,2.715) B9(-2.35,2.715) B12(-3.15,2.715)
VH3.96-4P直插座
  rect 2.6x3 hole 1.6: 1(5.94,-0.3)
  round 2.6 hole 1.6: 2(1.98,-0.3) 3(-1.98,-0.3) 4(-5.94,-0.3)
晶振贴片
  rect 3x1.5 smd: 1(-5,0) 2(5,0)
晶振贴片49SSMD
  rect 2.5x1 smd: 1(-2.8,0) 2(2.8,0)
松下贴片电位器3x3
  rect 1.2x1.4 smd: 1(-1,-1.75) 3(1,-1.75)
  rect 1.6x1.4 smd: 2(0,1.65)
电容插件M6.3
  oval 1.4x2 hole 0.8: 1(-1.25,0) 2(1.25,0)

## Nets
As in the schematic, except:
24V: C8.1 D2.2 U1.1
GND: C1.1 C2.1 C3.2 C4.2 C6.2 C8.2 C9.2 C10.2 C11.2 C12.1 C13.2 C15.1 C16.2 C17.2 C18.1 C19.1 C20.1 C21.1 C22.1 C23.1 C24.2 C25.1 C26.2 C27.2 C32.2 C33.2 C34.2 C35.2 C36.2 C37.2 C38.1 D3.2 DZ2.1 DZ3.1 DZ4.1 DZ5.1 J1.1 NOREF#4.5 NOREF#7.5 NOREF#8.5 NOREF#9.5 NOREF#10.5 NOREF#13.5 NOREF#14.4 NOREF#16.5 NOREF#20.5 NOREF#24.5 NOREF#25.5 NOREF#26.5 NOREF#30.5 NOREF#36.5 NOREF#37.4 NOREF#47.5 NOREF#49.5 NOREF#52.5 P1.3 P2.1 P2.2 P2.3 P2.4 P2.A1 P2.A12 P2.B1 P2.B12 P3.2 P4.1 P4.4 P5.1 P6.1 P10.6 P10.7 Q1.3 Q2.3 R6.1 R7.1 R14.2 R23.2 R24.1 R25.2 R26.1 R31.1 R32.1 R35.2 R36.2 R37.2 R38.2 R39.2 R40.2 R41.2 R42.2 R43.2 R44.2 R45.2 U1.2 U2.1 U3.1 U4.2 U5.8 U5.23 U5.35 U5.47 U7.2 U8.3 U8.18 U8.29 U9.3 U9.18 U9.29 U10.3
VCC: C2.2 C9.1 C12.2 C34.1 C35.1 D1.2 D5.1 DZ2.2 J1.3 R15.1 R16.1 R33.1 R34.1 U1.3 U3.3 U8.15 U9.15 U10.5
NETDZ4_2: DZ4.2 R9.2 U10.4
SPINDLE_PWM: U5.29 U10.2
VM: C6.1 C23.2 C24.1 C25.2 C26.1 C30.2 C31.2 D2.1 DZ3.2 NOREF#55.2 P1.4 P3.1 R22.2 R45.1 U8.22 U8.28 U9.22 U9.28

Pads without a net: NOREF 1; NOREF#2 1; NOREF#3 0; NOREF#5 1; NOREF#6 1; NOREF#11 1; NOREF#12 1; NOREF#15 1; NOREF#18 1; NOREF#19 1; NOREF#21 1; NOREF#22 1; NOREF#23 1; NOREF#27 0; NOREF#28 1; NOREF#29 1; NOREF#31 1; NOREF#32 1; NOREF#33 1; NOREF#34 1; NOREF#35 1; NOREF#38 1; NOREF#39 1; NOREF#40 1; NOREF#41 0; NOREF#42 1; NOREF#43 1; NOREF#44 1; NOREF#45 1; NOREF#46 1; NOREF#48 1; NOREF#50 1; NOREF#51 1; NOREF#53 1; NOREF#54 0; NOREF#56 1; P2 A5 A8 B5 B8; P4 5; P10 2 8; U2 9 10 11 12 14 15; U5 1 2 32 33; U8 7 20 25; U9 7 20 25; U10 1

## Via types
v1: diameter 0.5, hole 0.3, Top Layer to Bottom Layer, 320 vias

## Routing (per net, layer and track width the routed paths; a pad name or vN(x,y) marks a point on that pad's centre or on a via; arc(x,y) is an arc through that point)
2.5V: length 56.4
  Top Layer w0.3: v1(46.7,34.1) 46.1,33.5 R29.2 ; R28.2 24.5,34 26,35.5 v1(48.1,35.5) 65.4,35.5 ; 70.21,38.4 70.21,35.61 70.22,35.6 70.12,35.5 63.9,35.5 64.7,35.5
  Bottom Layer w0.3: v1(46.7,34.1) v1(48.1,35.5)
3V3: length 108.9
  Top Layer w0.3: 42.9,51.1 42.9,51 41.95,50.05 U5.36 38.75,50.05 37.5,48.8 35.26,48.8 34.73,49.33 34.73,49.8 ; 42.9,51.1 46.1,51.1 ; 42.9,51.1 42.9,54.3 41.75,55.45 U5.24 41.1,57.1 40.23,57.97 40.23,60.63 40.5,60.9 45,60.9 ; U5.9 46.55,54.05 46.1,53.6 46.1,51.1 ; 46.1,51.1 46.1,51 47.25,49.85 U5.48 v1(48,48.5) 48.51,48.5 48.97,48.03 C21.2 ; R2.1 81.8,57 83.91,54.89 C10.1 ; R2.1 82,57.6 ; R2.1 81.3,57.8 v1(80.4,57.8) ; R8.1 59.7,55.2 60.4,55.9 v1(60.4,57.8) 60.4,58.7 58.2,60.9 45,60.9 ; C22.2 34.6,49.83 R27.1 R30.1 ; 45,59.9 45,60.9 ; 40.03,59.9 40.03,59.93
  Top Layer w1: 84.3,51.2 84.3,54.01 C10.1 ; U3.4 U3.2
  Bottom Layer w0.3: v1(60.4,57.8) v1(80.4,57.8) ; v1(48,48.5) 48,45.46 P5.2
5VV: length 24.2
  Top Layer w0.6: P1.2 79.2,6.1 79.2,16.6 78.2,17.6 v1(78.2,22.1) ; v1(73.6,22.1) D6.1
  Bottom Layer w0.6: v1(73.6,22.1) v1(78.2,22.1)
24V: length 22.6
  Top Layer w1: 84.2,28.02 84.2,39.5 82.52,41.18 U1.1 ; 84.2,28.02 84.2,25.7 D2.2 ; 84.2,28.02 84.81,27.41 C8.1
GND: length 62.9
  Top Layer w0.3: v1(46.9,53.2) 47.25,53.55 U5.8 ; 54.44,32.67 v1(54.44,33.99) ; 26.83,31.12 28.38,32.68 ; U8.18 NOREF#47.5 ; 74.1,57.2 C19.1 74.2,57.2 v1(75,56.4) ; v1(60.3,53.2) 58.85,53.2 58.9,53.15 R6.1 ; v1(45.7,50.3) 46,50.3 46.75,49.55 U5.47 46.75,46.98 C21.1 ; C3.2 26.83,58.13 26.15,57.45 U2.1 ; C32.2 20.02,31.13 20.6,30.55 ; NOREF#9.5 29.46,23.6 U8.3 ; 40.24,31.13 41.57,31.13 42.14,30.55 ; C18.1 64.9,57.2 v1(64.1,56.4) ; 41.77,59.9 42.25,59.42 U5.23 ; C36.2 v1(32.9,33.99) ; C1.1 C2.1 ; 28.7,32.68 v1(28.7,34) ; C22.1 37.65,49.8 38.4,50.55 U5.35 41.25,50.55 v1(41.9,51.2) ; NOREF#20.5 51,23.6 U9.3 ; v1(64,47.5) DZ5.1 ; 50.24,32.68 v1(50.24,34) ; R7.1 v1(58.9,58.5) ; v1(18.9,52.6) 20.2,52.6 ; U9.18 NOREF#13.5 ; v1(64,51) Q2.3 ; 48.37,31.12 49.93,32.68 ; v1(13.2,47.9) U4.2
  vias: v1(15.23,55.7) v1(18.3,24.9) v1(18.3,24.1) v1(18.3,23.3) v1(18.3,22.5) v1(18.3,21.7) v1(18.3,20.9) v1(18.3,20.1) v1(18.3,19.3) v1(18.3,18.5) v1(18.3,17.7) v1(19.1,24.9) v1(19.1,24.1) v1(19.1,23.3) v1(19.1,22.5) v1(19.1,21.7) v1(19.1,20.9) v1(19.1,20.1) v1(19.1,19.3) v1(19.1,18.5) v1(19.1,17.7) v1(19.6,31.13) v1(21.1,59.8) v1(21.1,59) v1(21.9,59.8) v1(21.9,59) v1(22.7,59.8) v1(22.7,59) v1(23.5,59.8) v1(23.5,59) v1(24.13,40.13) v1(24.13,39.33) v1(24.3,59.8) v1(24.3,59) v1(24.93,40.13) v1(24.93,39.33) v1(25.73,40.13) v1(25.73,39.33) v1(26.53,40.13) v1(26.53,39.33) v1(27.33,40.13) v1(27.33,39.33) v1(28.13,40.13) v1(28.13,39.33) v1(28.93,40.13) v1(28.93,39.33) v1(29.73,40.13) v1(29.73,39.33) v1(30.53,40.13) v1(30.53,39.33) v1(31.33,40.13) v1(31.33,39.33) v1(31.6,59.8) v1(31.6,59) v1(32.4,59.8) v1(32.4,59) v1(33.2,59.8) v1(33.2,59) v1(34,59.8) v1(34,59) v1(34.8,59.8) v1(34.8,59) v1(39.3,24.9) v1(39.3,24.1) v1(39.3,23.3) v1(39.3,22.5) v1(39.3,21.7) v1(39.3,20.9) v1(39.3,20.1) v1(39.3,19.3) v1(39.3,18.5) v1(39.3,17.7) v1(39.3,12.23) v1(39.3,11.43) v1(39.3,10.63) v1(39.3,9.83) v1(39.3,9.03) v1(39.3,8.23) v1(39.4,47.23) v1(39.4,46.43) v1(39.4,45.63) v1(39.4,44.83) v1(40.1,24.9) v1(40.1,24.1) v1(40.1,23.3) v1(40.1,22.5) v1(40.1,21.7) v1(40.1,20.9) v1(40.1,20.1) v1(40.1,19.3) v1(40.1,18.5) v1(40.1,17.7) v1(40.1,12.23) v1(40.1,11.43) v1(40.1,10.63) v1(40.1,9.83) v1(40.1,9.03) v1(40.1,8.23) v1(40.2,47.23) v1(40.2,46.43) v1(40.2,45.63) v1(40.2,44.83) v1(41.1,31.13) v1(42.96,59.9) v1(43.66,59.9) v1(44.1,52.98) v1(44.1,52.23) v1(44.9,52.98) v1(44.9,52.23) v1(53.59,40) v1(53.59,39.2) v1(54.4,40) v1(54.4,39.2) v1(55.19,40) v1(55.19,39.2) v1(56,40) v1(56,39.2) v1(56.79,40) v1(56.79,39.2) v1(57.59,40) v1(57.59,39.2) v1(58.4,40) v1(58.4,39.2) v1(59.19,40) v1(59.19,39.2) v1(59.9,24.9) v1(59.9,24.1) v1(59.9,23.3) v1(59.9,22.5) v1(59.9,21.7) v1(59.9,20.9) v1(59.9,20.1) v1(59.9,19.3) v1(59.9,18.5) v1(59.9,17.7) v1(59.9,12.2) v1(59.9,11.4) v1(59.9,10.6) v1(59.9,9.8) v1(59.9,9) v1(59.9,8.2) v1(60,40) v1(60,39.2) v1(60.7,24.9) v1(60.7,24.1) v1(60.7,23.3) v1(60.7,22.5) v1(60.7,21.7) v1(60.7,20.9) v1(60.7,20.1) v1(60.7,19.3) v1(60.7,18.5) v1(60.7,17.7) v1(60.7,12.2) v1(60.7,11.4) v1(60.7,10.6) v1(60.7,9.8) v1(60.7,9) v1(60.7,8.2) v1(62.5,33.7) v1(62.5,32.9) v1(63.3,33.7) v1(63.3,32.9) v1(64.1,33.7) v1(64.1,32.9) v1(64.9,33.7) v1(64.9,32.9) v1(69.9,23.43) v1(70.6,40.9) v1(70.6,40.1) v1(70.7,23.43) v1(71.4,40.9) v1(71.4,40.1) v1(72.2,40.9) v1(72.2,40.1) v1(73,40.9) v1(73,40.1) v1(80.16,56.1) v1(80.16,55.2) v1(89.6,32.3) v1(89.6,31.5) v1(89.6,30.1) v1(89.6,29.3) v1(89.6,27.8) v1(89.6,27) v1(90.4,32.3) v1(90.4,31.5) v1(90.4,30.1) v1(90.4,29.3) v1(90.4,27.8) v1(90.4,27) v1(91.2,32.3) v1(91.2,31.5) v1(91.2,30.1) v1(91.2,29.3) v1(91.2,27.8) v1(91.2,27) v1(92,32.3) v1(92,31.5) v1(92,30.1) v1(92,29.3) v1(92,27.8) v1(92,27) v1(92.8,32.3) v1(92.8,31.5) v1(92.8,30.1) v1(92.8,29.3) v1(92.8,27.8) v1(92.8,27) v1(93.6,32.3) v1(93.6,31.5) v1(93.6,30.1) v1(93.6,29.3) v1(93.6,27.8) v1(93.6,27) v1(94.4,32.3) v1(94.4,31.5) v1(94.4,30.1) v1(94.4,29.3) v1(94.4,27.8) v1(94.4,27) v1(95.2,32.3) v1(95.2,31.5) v1(95.2,30.1) v1(95.2,29.3) v1(95.2,27.8) v1(95.2,27) v1(96,32.3) v1(96,31.5) v1(96,30.1) v1(96,29.3) v1(96,27.8) v1(96,27)
VCC: length 236.7
  Top Layer w0.3: R15.1 74.8,47.4 v1(75.2,47.4) ; 30.8,34.8 27.2,34.8 26.6,34.2 C34.1 25.6,31.67 25.6,25.9 25.9,25.6 U8.15 ; 30.8,34.8 48.14,34.8 ; 30.8,34.8 R33.1 30.8,32.68 ; U9.15 47.44,25.6 47.14,25.9 47.14,31.67 48.14,32.67 48.14,34.8 ; 51.94,34.8 52.34,34.4 52.34,32.7 ; 51.94,34.8 v1(64.8,34.8) ; 51.94,34.8 48.14,34.8 ; v1(68.2,39) U10.5 ; 72.4,63.1 72.4,59.86 J1.3 ; C2.2 16.77,57 ; v1(69.7,51.36) 70.26,50.8 R16.1 ; 14.3,52.5 13.9,52.9 13.9,57.6 14.41,58.11 16.49,58.11 16.77,57.83 ; v1(73.6,27.1) D5.1
  Top Layer w0.6: 78.8,51.2 77.9,50.3 v1(77.9,47.4) 77.9,31 ; 78.8,51.2 78.8,58.5 74.2,63.1 72.4,63.1 ; 78.8,51.2 82,51.2 81.8,51.4 C12.2 ; DZ2.2 78.7,24.9 77.9,25.7 77.9,31 ; 16.77,57.47 C2.2 16.77,58.97 20.9,63.1 72.4,63.1 ; 77.9,31 77.95,31.05 C9.1 80.6,32.45 U1.3 ; 72.4,63.1 73.9,63.1
  Top Layer w1: 79.7,25.2 DZ2.2
  Bottom Layer w0.3: v1(73.6,27.1) 77.7,27.1 ; v1(64.8,34.8) v1(77.9,34.8) ; 68.2,34.8 v1(68.2,39) ; v1(75.2,47.4) v1(77.9,47.4) ; v1(69.7,51.36) 78.54,51.36 v1(78.8,51.1)
  vias: v1(77.9,27.1)
BOOT0: length 21.4
  Top Layer w0.3: v1(56,42.6) 51.9,42.6 50.2,44.3 46.7,44.3 45.25,45.75 U5.44 ; v1(56,46.8) R6.2
  Bottom Layer w0.3: v1(56,42.6) 56,45.3 ; 56,45.3 56,44.2 ; 56,45.3 v1(56,46.8)
BOOT1: length 17.5
  Top Layer w0.3: v1(43.75,58.55) U5.20 43.75,58.3 ; R7.2 57.3,58.55
  Bottom Layer w0.3: v1(43.75,58.55) v1(57.25,58.55)
EX: length 37.2
  Top Layer w0.3: R16.2 v1(73.8,49.6) R20.2 ; v1(61.6,49.6) 61.6,45.6 60.9,44.9 52.3,44.9 51.9,45.3 51.9,50.4 50.75,51.55 U5.4
  Bottom Layer w0.3: v1(61.6,49.6) v1(73.8,49.6)
LO: length 43.5
  Top Layer w0.3: U5.3 50.55,51.05 51.3,50.3 51.3,45.1 52.2,44.2 v1(61,44.2) ; v1(62.1,29.8) 71.1,29.8 71.6,29.3 R11.2
  Bottom Layer w0.3: v1(61,44.2) 61,30.9 v1(62.1,29.8)
LO_OUT: length 26.2
  Top Layer w0.6: v1(72.5,16.1) 72.5,17.6 69.39,20.71 F1.2 69.39,21.11 ; v1(78.2,16.1) 78.2,9.06 P1.1
  Bottom Layer w0.6: v1(72.5,16.1) v1(78.2,16.1)
LX: length 135
  Top Layer w0.3: R18.1 R17.2 76.4,50.4 v1(76.4,17.9) 76.4,12.7 70.1,6.4 v1(70.1,4.4)
  Bottom Layer w0.3: 54.4,4.4 56.5,4.4 ; 54.4,4.4 v1(70.1,4.4) ; 54.4,4.4 37.8,4.4 34.3,7.9 19.3,7.9 16.75,5.35 P10.5 ; P4.3 94.6,17.9 v1(76.4,17.9)
LY: length 147.2
  Top Layer w0.3: v1(71.1,5) 71.1,6.6 77.07,12.57 77.07,50.93 v1(75.3,52.7) ; R12.1 v1(65.5,54.1) R13.1 ; P10.1 13.05,2.4 14.3,2.4 P10.4
  Bottom Layer w0.3: P4.2 92.86,17.1 v1(77.1,17.1) ; 57.8,5 38.1,5 34.6,8.5 18.7,8.5 15.5,5.3 P10.4 ; 57.8,5 58.3,5 ; 57.8,5 v1(71.1,5) ; v1(65.5,54.1) 66.9,52.7 v1(75.3,52.7)
MOTOR_EN: length 89.3
  Top Layer w0.3: v1(45.75,55.55) U5.16 45.75,58.65 46.9,59.8 ; U9.2 54.34,23.1 v1(59.61,28.37) ; v1(59.61,36.2) v1(48.8,36.2) 38.03,36.2 v1(38.01,36.21) ; v1(38.01,28.31) 32.8,23.1 U8.2
  Bottom Layer w0.3: v1(38.01,28.31) v1(38.01,36.21) ; v1(48.8,36.2) 52.3,39.7 52.3,55.8 50.2,57.9 47.7,57.9 45.75,55.95 v1(45.75,55.55) ; v1(59.61,28.37) v1(59.61,36.2)
MX_1A: length 41.5
  Top Layer w0.3: 28.46,19.94 U8.24
  Top Layer w0.6: P7.2 33.26,3.4 29.46,7.2 ; 29.46,7.2 27.48,9.18 ; 29.46,7.2 30.46,6.2 ; 27.48,9.18 26.1,10.56 26.1,12.2 R38.1 ; 27.48,9.18 26.6,10.06 ; 26.1,12 26.1,17.6 28.36,19.86
  Bottom Layer w0.6: P7.2 30.56,5 24.7,5 24.25,4.55 P10.11
MX_1B: length 31.3
  Top Layer w0.3: 26.46,22.6 26.46,22.4 25.83,21.77
  Top Layer w0.6: P10.12 26.8,2.3 P7.1 30.62,3.07 R37.1 23.36,9.4 22.76,10 22.76,18.7 25.83,21.77
MX_2A: length 38.8
  Top Layer w0.3: 29.46,19.84 U8.26
  Top Layer w0.6: 29.46,19.84 31.8,17.5 31.8,7.9 35.8,3.9 P7.3 ; 31.9,12.2 32.7,12.2
  Bottom Layer w0.6: P10.10 23,4.9 24.1,6 32.1,6 P7.3
MX_2B: length 49.4
  Top Layer w0.3: 31.46,22.6 31.46,22.24 32.4,21.3
  Top Layer w0.6: 32.1,21.6 33.4,20.3 ; 33.4,20.3 32.7,21 ; 33.4,20.3 34.9,18.8 34.9,10.89 R40.1 38.44,4.37 P7.4
  Bottom Layer w0.6: P10.9 21.75,5.35 23.4,7 33.74,7 P7.4
MX_DIR: length 61.6
  Top Layer w0.3: U5.13 v1(48.2,57.1) ; v1(23,35.3) 25.5,37.8 v1(46,37.8) ; U8.19 24.9,23.6 21.8,26.7 v1(21.8,28.2)
  Bottom Layer w0.3: v1(23,35.3) 23,29.4 v1(21.8,28.2) ; v1(46,37.8) 46.3,37.8 49.6,41.1 49.6,55.7 v1(48.2,57.1)
MX_STEP: length 55.7
  Top Layer w0.3: v1(23.66,34.56) 26.1,37 v1(46.6,37) ; v1(23.6,29.2) 23.6,27 25.5,25.1 U8.16 ; U5.10 50.15,54.55 v1(50.4,54.3)
  Bottom Layer w0.3: v1(23.6,29.2) 23.6,34.5 ; v1(46.6,37) 50.4,40.8 v1(50.4,54.3)
MY1_1A: length 26.3
  Top Layer w0.3: 50,19.94 U9.24
  Top Layer w0.6: 49.9,19.86 47.64,17.6 47.64,14.8 ; 47.64,12.9 47.64,14.8 ; 47.64,14.8 47.64,8.6 ; R42.1 47.54,12.2 ; 47.64,8.6 47.64,3.88 P8.2 ; 47.64,8.6 47.64,6.68
MY1_1B: length 24
  Top Layer w0.3: 47.36,21.76 48,22.4 48,22.6
  Top Layer w0.6: P8.1 45.83,4.71 R41.1 44.9,9.4 44.3,10 44.3,18.7 47.36,21.76
MY1_2A: length 25.6
  Top Layer w0.3: 51,20 U9.26
  Top Layer w0.6: 53.34,10.7 53.34,12.1 ; 53.34,10.7 53.34,7.04 P8.3 ; 53.34,10.7 53.34,9.84 ; 53.34,12.1 53.34,13.7 ; 53.34,12.1 53.44,12.2 R43.1 ; 53.34,13.7 53.34,17.5 51,19.84 ; 53.34,13.7 53.34,12.7
MY1_2B: length 25.9
  Top Layer w0.3: 53.94,21.3 53.64,21.6 53,22.24 53,22.6
  Top Layer w0.6: 54.95,8.81 R44.1 ; R44.1 54.95,6.01 P8.4 ; R44.1 56.44,10.89 56.44,18.8 54.94,20.3 ; 54.94,20.3 53.64,21.6 ; 54.94,20.3 54.24,21
MY_DIR: length 46.6
  Top Layer w0.3: v1(50.4,56.5) 48.4,58.5 47.05,58.5 46.75,58.2 U5.14 ; U9.19 46.44,23.6 43.34,26.7 v1(43.34,28.2)
  Bottom Layer w0.3: v1(50.4,56.5) 51.7,55.2 51.7,40.2 46,34.5 46,28.9 45.3,28.2 v1(43.34,28.2)
MY_STEP: length 36.4
  Top Layer w0.3: U9.16 47.04,25.1 45.14,27 v1(45.14,29.2) ; v1(50.4,55.3) 50.15,55.05 U5.11
  Bottom Layer w0.3: v1(45.14,29.2) 45.14,34.54 51.1,40.5 51.1,54.6 v1(50.4,55.3)
NETC4_1: length 3.4
  Top Layer w0.254: U2.4 22.79,53.64 21.75,52.6
NETC5_1: length 9
  Top Layer w0.3: C5.1 33.5,47.7 32.8,48.4 32.8,52.9 32.06,53.64 U2.13
NETC11_1: length 12.1
  Top Layer w0.254: C11.1 32.76,45.97 32.09,45.3 Y1.2 27.5,45.3 27.2,45.6 27.2,48.5 25.87,49.83 U2.7
NETC13_1: length 9.1
  Top Layer w0.254: 24.76,45.44 Y1.1 ; 24.76,45.44 24.69,45.5 22.87,45.5 C13.1 ; 24.76,45.44 26.34,45.44 26.6,45.7 26.6,48 26.07,48.53 U2.8
NETC28_1: length 12.6
  Top Layer w0.3: C28.1 37.33,32.67 38.1,31.9 38.1,29.42 32.78,24.1 U8.4
NETC28_2: length 9.5
  Top Layer w0.3: C28.2 37.1,29.2 32.5,24.6 U8.5
NETC29_1: length 12.7
  Top Layer w0.3: 58.64,32.67 58.87,32.67 59.74,31.8 59.74,29.52 54.32,24.1 U9.4
NETC29_2: length 9.5
  Top Layer w0.3: 58.64,31.13 58.64,29.2 54.04,24.6 U9.5
NETC30_1: length 7.9
  Top Layer w0.3: C30.1 35,27.9 32.2,25.1 U8.6
NETC31_1: length 7.9
  Top Layer w0.3: 56.54,31.13 56.54,27.9 53.74,25.1 U9.6
NETC32_1: length 18.8
  Top Layer w0.3: 21.6,33.95 20.32,32.67 C32.1 17.97,32.67 17.7,32.4 17.7,30.2 19,28.9 22.4,28.9 22.75,28.55 22.75,26.95 25.1,24.6 U8.17
NETC33_1: length 18.8
  Top Layer w0.3: 43.14,33.95 41.87,32.67 C33.1 39.52,32.67 39.2,32.36 39.2,30.24 39.37,30.07 39.63,29.81 40.54,28.9 43.94,28.9 44.29,28.55 44.29,26.95 46.64,24.6 U9.17
NETC36_1: length 5.5
  Top Layer w0.3: U8.8 30.46,28.68 C36.1
NETC37_1: length 5.5
  Top Layer w0.3: 54.44,31.13 52,28.68 U9.8
NETC38_2: length 79.9
  Top Layer w0.4: v1(66.7,5.7) 66.9,5.7 73.6,12.4 D6.2 72.13,20.4 C38.2
  Bottom Layer w0.6: v1(66.7,5.7) 38.6,5.7 34.9,9.4 18.3,9.4 14.25,5.35 P10.3
NETD3_1: length 1.8
  Top Layer w0.3: R2.2 85.2,57.3 D3.1
NETD5_2: length 2.4
  Top Layer w0.3: R10.1 72.8,26.3 D5.2
NETDZ4_2: length 10.2
  Top Layer w0.3: 69.9,42.2 R9.2 ; U10.4 67.25,37.95 66.8,38.4 66.8,40.3 68.9,42.4 69.6,42.4 ; 69.6,42.4 DZ4.2 ; 69.6,42.4 69.48,42.28 69.57,42.2 69.6,42.2
NETDZ5_2: length 9.4
  Top Layer w0.3: Q2.2 67.1,48.6 DZ5.2 70.5,46.4 R15.2 R19.2
NETF1_1: length 7.5
  Top Layer w1: R10.2 69.2,24.7 Q1.2 68.7,24.1 66.41,21.81 F1.1
NETJ1_2: length 11.7
  Top Layer w0.3: 69.7,54 70.7,53 R17.1 ; 69.7,54 68.7,53 R12.2 ; 69.7,54 J1.2
NETP3_3: length 49.5
  Top Layer w0.3: P3.3 61.54,3.74 62.7,4.9 67,4.9 74.9,12.8 74.9,15.7 ; 74.9,15.7 74.9,41.1 R9.1 ; 74.9,15.7 74.9,14.56
NETP6_2: length 45.3
  Top Layer w0.3: P6.2 69.34,6.44 75.6,12.7 75.6,42.5 R19.1
NETQ1_1: length 5
  Top Layer w0.3: Q1.1 67.9,27.8 R14.1 R11.1
NETQ2_1: length 6.5
  Top Layer w0.3: Q2.1 67.3,49.9 68.6,48.6 R20.1
NETR1_1: length 3.2
  Top Layer w0.254: U2.2 22.42,56.18 R1.1
NETR3_1: length 3
  Top Layer w0.254: U2.3 22.01,54.91 R3.1
NETR23_1: length 7.7
  Top Layer w0.3: U8.27 29.96,20.64 30.25,20.35
  Top Layer w0.6: R23.1 33.41,17.19 30.45,20.15
NETR24_2: length 8.1
  Top Layer w0.3: U8.23 27.96,20.66 27.4,20.1
  Top Layer w0.6: 27.4,20.1 24.29,16.99 R24.2
NETR25_1: length 9.7
  Top Layer w0.3: U9.27 51.5,20.64 51.79,20.35
  Top Layer w0.6: 51.99,20.15 54.95,17.19 R25.1 54.95,16.95
NETR26_2: length 7.8
  Top Layer w0.3: U9.23 49.5,20.66 49.14,20.3
  Top Layer w0.6: R26.2 45.83,16.99 48.94,20.1
NETR28_1: length 2.1
  Top Layer w0.3: R28.1 23.15,31.1 22.6,30.55
NETR29_1: length 2.1
  Top Layer w0.3: 44.14,30.55 44.69,31.1 46.04,31.1
NETR33_2: length 12.4
  Top Layer w0.3: v1(27.3,27.7) 27.45,27.55 27.45,26.6 ; U8.10 29.46,27.74 ; 29.46,27.74 v1(28.96,27.74) ; 29.46,27.74 29.96,27.74 ; v1(28.96,27.74) U8.11 ; v1(28.96,27.74) 28.74,27.74 28.46,27.46 U8.12 ; 29.96,27.74 29.96,30.06 30.8,30.9 R33.2 ; 29.96,27.74 U8.9
  Bottom Layer w0.3: v1(28.96,27.74) 28.91,27.7 v1(27.3,27.7)
NETR34_2: length 12.4
  Top Layer w0.3: v1(48.84,27.7) 49,27.55 49,26.6 ; U9.9 51.5,27.74 ; 51.5,27.74 51,27.74 ; 51.5,27.74 51.5,30.06 52.34,30.9 52.34,31.1 ; 51,27.74 v1(50.5,27.74) ; 51,27.74 U9.10 ; v1(50.5,27.74) 50.29,27.74 50,27.46 U9.12 ; v1(50.5,27.74) U9.11
  Bottom Layer w0.3: v1(48.84,27.7) 50.46,27.7
NETR35_1: length 4.8
  Top Layer w0.3: 28.7,31.08 28.7,30.7 27.96,29.96 U8.13
NETR36_1: length 4.8
  Top Layer w0.3: 50.24,31.08 50.24,30.7 49.5,29.96 U9.13
NETU2_5: length 9
  Top Layer w0.254: U4.6 19.97,48.85 23.49,52.37 U2.5
NETU2_6: length 9.3
  Top Layer w0.254: U4.4 18.85,46.95 22.97,51.07 24.73,51.07 U2.6
NRST: length 20.3
  Top Layer w0.3: C15.2 R8.2 55.5,55.2 55.2,55.5 55.2,59.1 54.5,59.8 52.1,59.8 51.7,59.4 51.7,54.3 50.45,53.05 U5.7
RST: length 19.1
  Top Layer w0.3: U5.41 43.75,41.85 43.1,41.2 39.5,41.2 36.07,44.63 C5.2
RXD: length 28.8
  Top Layer w0.3: U5.31 38.25,52.55 v1(37.5,51.8) R27.2 ; v1(18.9,56.8) R1.2
  Bottom Layer w0.3: v1(37.5,51.8) 37.3,52 20.5,52 18.1,54.4 18.1,56 v1(18.9,56.8)
SPINDLE_PWM: length 63.6
  Top Layer w0.3: 56.6,62.2 58.7,62.2 ; 56.6,62.2 39.7,62.2 37,59.5 37,55.4 38.85,53.55 U5.29 ; 56.6,62.2 v1(63,62.2) ; 63,42.2 63,43.4 ; 63,43.4 63,39.9 64,38.9 U10.2 ; 63,43.4 v1(63,60.8)
  Bottom Layer w0.3: v1(63,60.8) v1(63,62.2)
SWCLK: length 6.3
  Top Layer w0.3: P5.3 41.75,43.25 U5.37
SWDIO: length 12.1
  Top Layer w0.3: v1(37.5,50.7) 37.85,51.05 U5.34
  Bottom Layer w0.3: P5.4 37.5,44.96 v1(37.5,50.7)
TXD: length 25.5
  Top Layer w0.3: U5.30 38.25,53.05 v1(37.5,53.8) R30.2 ; v1(18.9,54.7) R3.2
  Bottom Layer w0.3: v1(18.9,54.7) 20.9,52.7 36.4,52.7 v1(37.5,53.8)
USB_DM: length 11.3
  Top Layer w0.25: 10.05,46.05 P2.A7 6.25,46.05 6,46.3 6,46.8 6.25,47.05 P2.B7
  Top Layer w0.3: U4.3 10.95,46.95 10.05,46.05
USB_DP: length 13.8
  Top Layer w0.25: P2.A6 9.45,46.55
  Top Layer w0.3: 9.45,46.55 v1(10.1,47.2) 11.75,48.85 U4.1 15,49.45 R21.2 ; P2.B6 9.85,45.55 v1(10.1,45.3)
  Bottom Layer w0.3: v1(10.1,45.3) v1(10.1,47.2)
VM: length 204.3
  Top Layer w0.3: 31.4,21 30.8,21.6 U8.28 ; 26.2,20.8 27,21.6 27.45,21.6 ; 73.19,32.8 73.19,31.49 72.5,30.8 60.3,30.8 ; C31.2 56.6,33.5 57.1,34 59.6,34 60.3,33.3 60.3,30.8 ; C30.2 35,33.5 35.5,34 38,34 38.7,33.3 38.7,27.6 v1(33.4,22.3) ; U9.28 52.34,21.6 52.94,21 ; 49,21.6 48.54,21.6 47.95,21 ; 60.3,30.8 60.3,27.6 v1(55,22.3)
  Top Layer w0.6: 73.2,35.6 73.19,35.59 73.19,32.8 ; 52.94,21 v1(54.95,18.99) ; 28.8,14.15 27.93,15.02 27.93,17.3 ; 50.43,14.15 49.55,15.02 49.55,17.3 ; v1(24.29,18.89) 26.4,21 ; 31.4,21 v1(33.41,18.99) ; v1(45.83,18.89) 47.95,21
  Top Layer w1: D2.1 83.4,20.92 DZ3.2
  Top Layer w2: 83.4,14.45 D2.1 ; P3.1 56.3,3.5 59.3,6.5 64.9,6.5 71.7,13.3 71.7,14
  Top Layer w3: 83.4,14.45 85.35,14.45 86,13.8 86,5.1
  Bottom Layer w0.6: 28.8,14.4 25.25,14.4 24.29,15.36 v1(24.29,18.89) ; 55.01,18.99 55.01,22.29 ; 33.41,14.45 v1(33.41,18.99) 33.41,22.29 ; 54.95,14.65 v1(54.95,18.99) ; 45.83,14.45 v1(45.83,18.89)
  Bottom Layer w1: C24.1 28.75,14.45 28.7,14.4
  Bottom Layer w2: C24.1 C26.1 NOREF#55.2 C6.1
VUSB: length 48
  Top Layer w0.254: U2.16 29.35,57.45 28.37,58.43 C3.1 28.37,60.03 27.7,60.7 20.3,60.7 18.1,58.5 18.1,55.2 17.6,54.7 C1.2 16.77,50.77 R21.1 16.6,50.1 15.8,49.3 15.8,47.8 ; P2.B9 6.85,48.65 5.41,47.21 5.41,45.26 6.72,43.95 P2.B4 14.15,43.95 15.8,45.6 15.8,47.8 ; U4.5 15.9,47.9 15.8,47.8
X_LIMT: length 43.4
  Top Layer w0.3: C19.2 72.2,57.17 v1(72.2,56.3) R18.2 ; U5.46 46.25,45.65 47,44.9 50.5,44.9 51.9,43.5 61.4,43.5 62.3,44.4 v1(62.3,55.3)
  Bottom Layer w0.3: v1(62.3,55.3) 71.2,55.3 v1(72.2,56.3)
XTAL1: length 13.3
  Top Layer w0.3: 53.5,48.9 53.5,51.5 52.95,52.05 U5.5 ; 53.5,48.9 53.6,49 C17.1 ; 53.5,48.9 Y2.1
XTAL2: length 13.5
  Top Layer w0.3: 53.5,53.1 Y2.2 ; 53.5,53.1 55.5,51.1 C16.1 ; 53.5,53.1 52.95,52.55 U5.6
Y_LIMT: length 41.8
  Top Layer w0.3: U5.28 39.1,54.05 37.6,55.55 37.6,59.2 39.9,61.5 63.9,61.5 ; R13.2 67.07,55.22 C18.2 67.07,57.43 65.4,59.1 65.4,60 63.9,61.5 ; 63.9,61.5 63.91,61.5

## Copper pours and planes (outline as drawn; the poured copper is in the pictures)
GND on Top Layer: -7,68.6 -7,-4.3 101,-4.3 101,68.1 -6.7,68.1
GND on Bottom Layer: -6.7,69.2 102.5,69.2 102.5,-6.3 -6.7,-6.3

Small or netless copper shapes (teardrops, artwork), in the pictures only: 1 on Bottom Layer

## Text on the board
Top Silkscreen Layer: PuDOWN | PuUP | LY-2axis-5.0-V1.1 | LXY Pull Set | X | X-MOTOR | Y | Y-MOTOR | 24V | GND | PWM | EX | LO | 5V | NC | LX | LY
